# EAGLE design H16R6 (EAGLE 9.6.1)

## Sheet 1 of 3
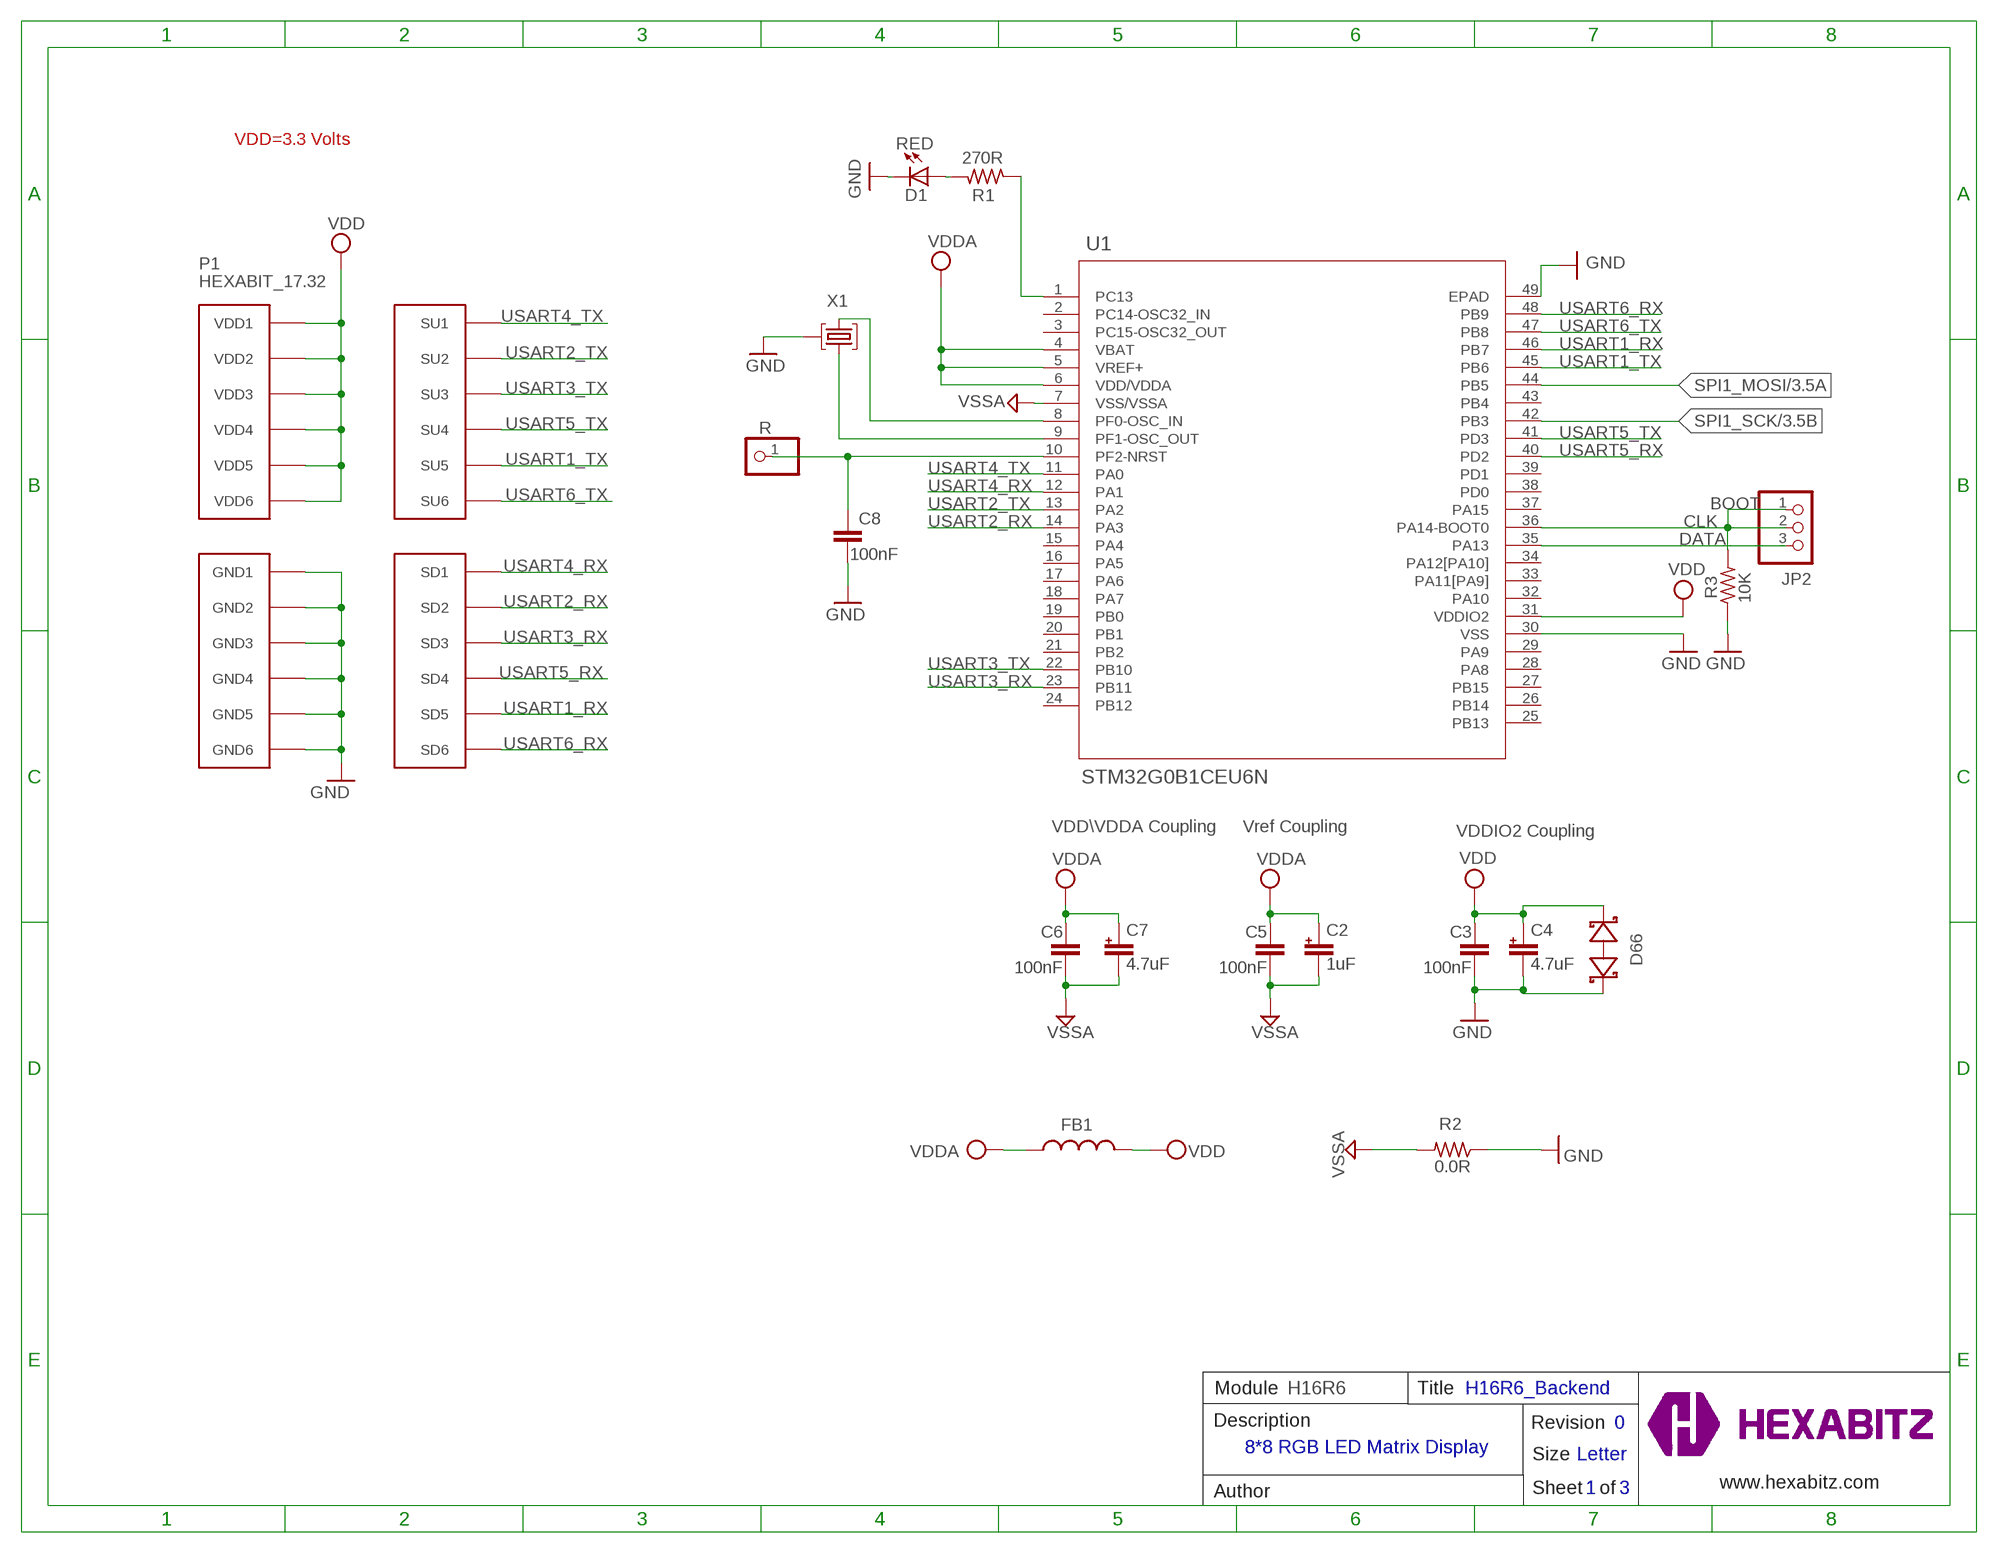
[diagram p0: schematic, sheet 1]

### Parts
C2  1uF  C-0402-POL  [C-0402-POL]
C3  100nF  C-0402  [C-0402]
C4  4.7uF  C-0402-POL  [C-0402-POL]
C5  100nF  C-0402  [C-0402]
C6  100nF  C-0402  [C-0402]
C7  4.7uF  C-0402-POL  [C-0402-POL]
C8  100nF  C-0402  [C-0402]
D1  RED  VLMS1300-GS08  [VLMS1300-GS08]
D66  BOURNS_CDSOD323-T03SCBOURNS_CDSOD323-T03SC_0_0  [BOURNS_CDSOD323-T03SC_0]
FB1  FB-TDK_MMZ1608Y300B  [FB-TDK_MMZ1608Y300B]
JP2  PINHD-1X3  [1X03]
P1  HEXABIT_17.32  [HEXABIT_17.32]
R  R  PINHD-1X1  [1X01]
R1  270R  R-0402  [R-0402]
R2  0.0R  R-0402  [R-0402]
R3  10K  R-0402  [R-0402]
TRIMBLE-LOGO1  HEXA-LOGO  [HEXA-LOGO]
U1  STM32G0B1CEU6N  [HEXABITZ_ICS_QFN_B1CEU6_STM-L]
X1  XTALL_CSTCE8M00G52  [XTALL_CSTCE8M00G52]

### Nets
CLK: JP2.1 JP2.2 R3.2 U1.36(PA14-BOOT0)
DATA: JP2.3 U1.35(PA13)
GND: C3.2 C4.2 C8.2 D1.C D66.1(A) P1.PAD_PD7(GND1) P1.PAD_PD8(GND2) P1.PAD_PD9(GND3) P1.PAD_PD10(GND4) P1.PAD_PD11(GND5) P1.PAD_PD12(GND6) R2.1 R3.1 U1.30(VSS) U1.49(EPAD) X1.P$2 ; also sheet 2,3
N$3: D1.A R1.2
N$4: C8.1 R.1 U1.10(PF2-NRST)
N$5: U1.9(PF1-OSC_OUT) X1.P$1
N$6: U1.8(PF0-OSC_IN) X1.P$3
N$117: R1.1 U1.1(PC13)
SPI1_MOSI: U1.44(PB5) ; also sheet 3
SPI1_SCK: U1.42(PB3) ; also sheet 3
USART1_RX: P1.PAD_PD5(SD5) U1.46(PB7)
USART1_TX: P1.PAD_PU5(SU5) U1.45(PB6)
USART2_RX: P1.PAD_PD2(SD2) U1.14(PA3)
USART2_TX: P1.PAD_PU2(SU2) U1.13(PA2)
USART3_RX: P1.PAD_PD3(SD3) U1.23(PB11)
USART3_TX: P1.PAD_PU3(SU3) U1.22(PB10)
USART4_RX: P1.PAD_PD1(SD1) U1.12(PA1)
USART4_TX: P1.PAD_PU1(SU1) U1.11(PA0)
USART5_RX: P1.PAD_PD4(SD4) U1.40(PD2)
USART5_TX: P1.PAD_PU4(SU4) U1.41(PD3)
USART6_RX: P1.PAD_PD6(SD6) U1.48(PB9)
USART6_TX: P1.PAD_PU6(SU6) U1.47(PB8)
VDD: C3.1 C4.1 D66.2(C) FB1.2 P1.PAD_PU7(VDD1) P1.PAD_PU8(VDD2) P1.PAD_PU9(VDD3) P1.PAD_PU10(VDD4) P1.PAD_PU11(VDD5) P1.PAD_PU12(VDD6) U1.31(VDDIO2) ; also sheet 3
VDDA: C2.1 C5.1 C6.1 C7.1 FB1.1 U1.4(VBAT) U1.5(VREF+) U1.6(VDD/VDDA)
VSSA: C2.2 C5.2 C6.2 C7.2 R2.2 U1.7(VSS/VSSA)
Unconnected: U1.2(PC14-OSC32_IN) U1.3(PC15-OSC32_OUT) U1.15(PA4) U1.16(PA5) U1.17(PA6) U1.18(PA7) U1.19(PB0) U1.20(PB1) U1.21(PB2) U1.24(PB12) U1.25(PB13) U1.26(PB14) U1.27(PB15) U1.28(PA8) U1.29(PA9) U1.32(PA10) U1.33(PA11[PA9]) U1.34(PA12[PA10]) U1.37(PA15) U1.38(PD0) U1.39(PD1) U1.43(PB4)

### Notes on the sheet
- VDD=3.3 Volts
- BOOT
- VDD\VDDA Coupling | Vref Coupling | VDDIO2 Coupling
- Module | H16R6 | Title | H16R6_Backend
- Description | Revision | 0
- 8*8 RGB LED Matrix Display
- Size | Letter
- www.hexabitz.com
- Author | Sheet   of | 1 | 3
- C:/Users/Admin/Desktop/logodraft.bmp

## Sheet 2 of 3
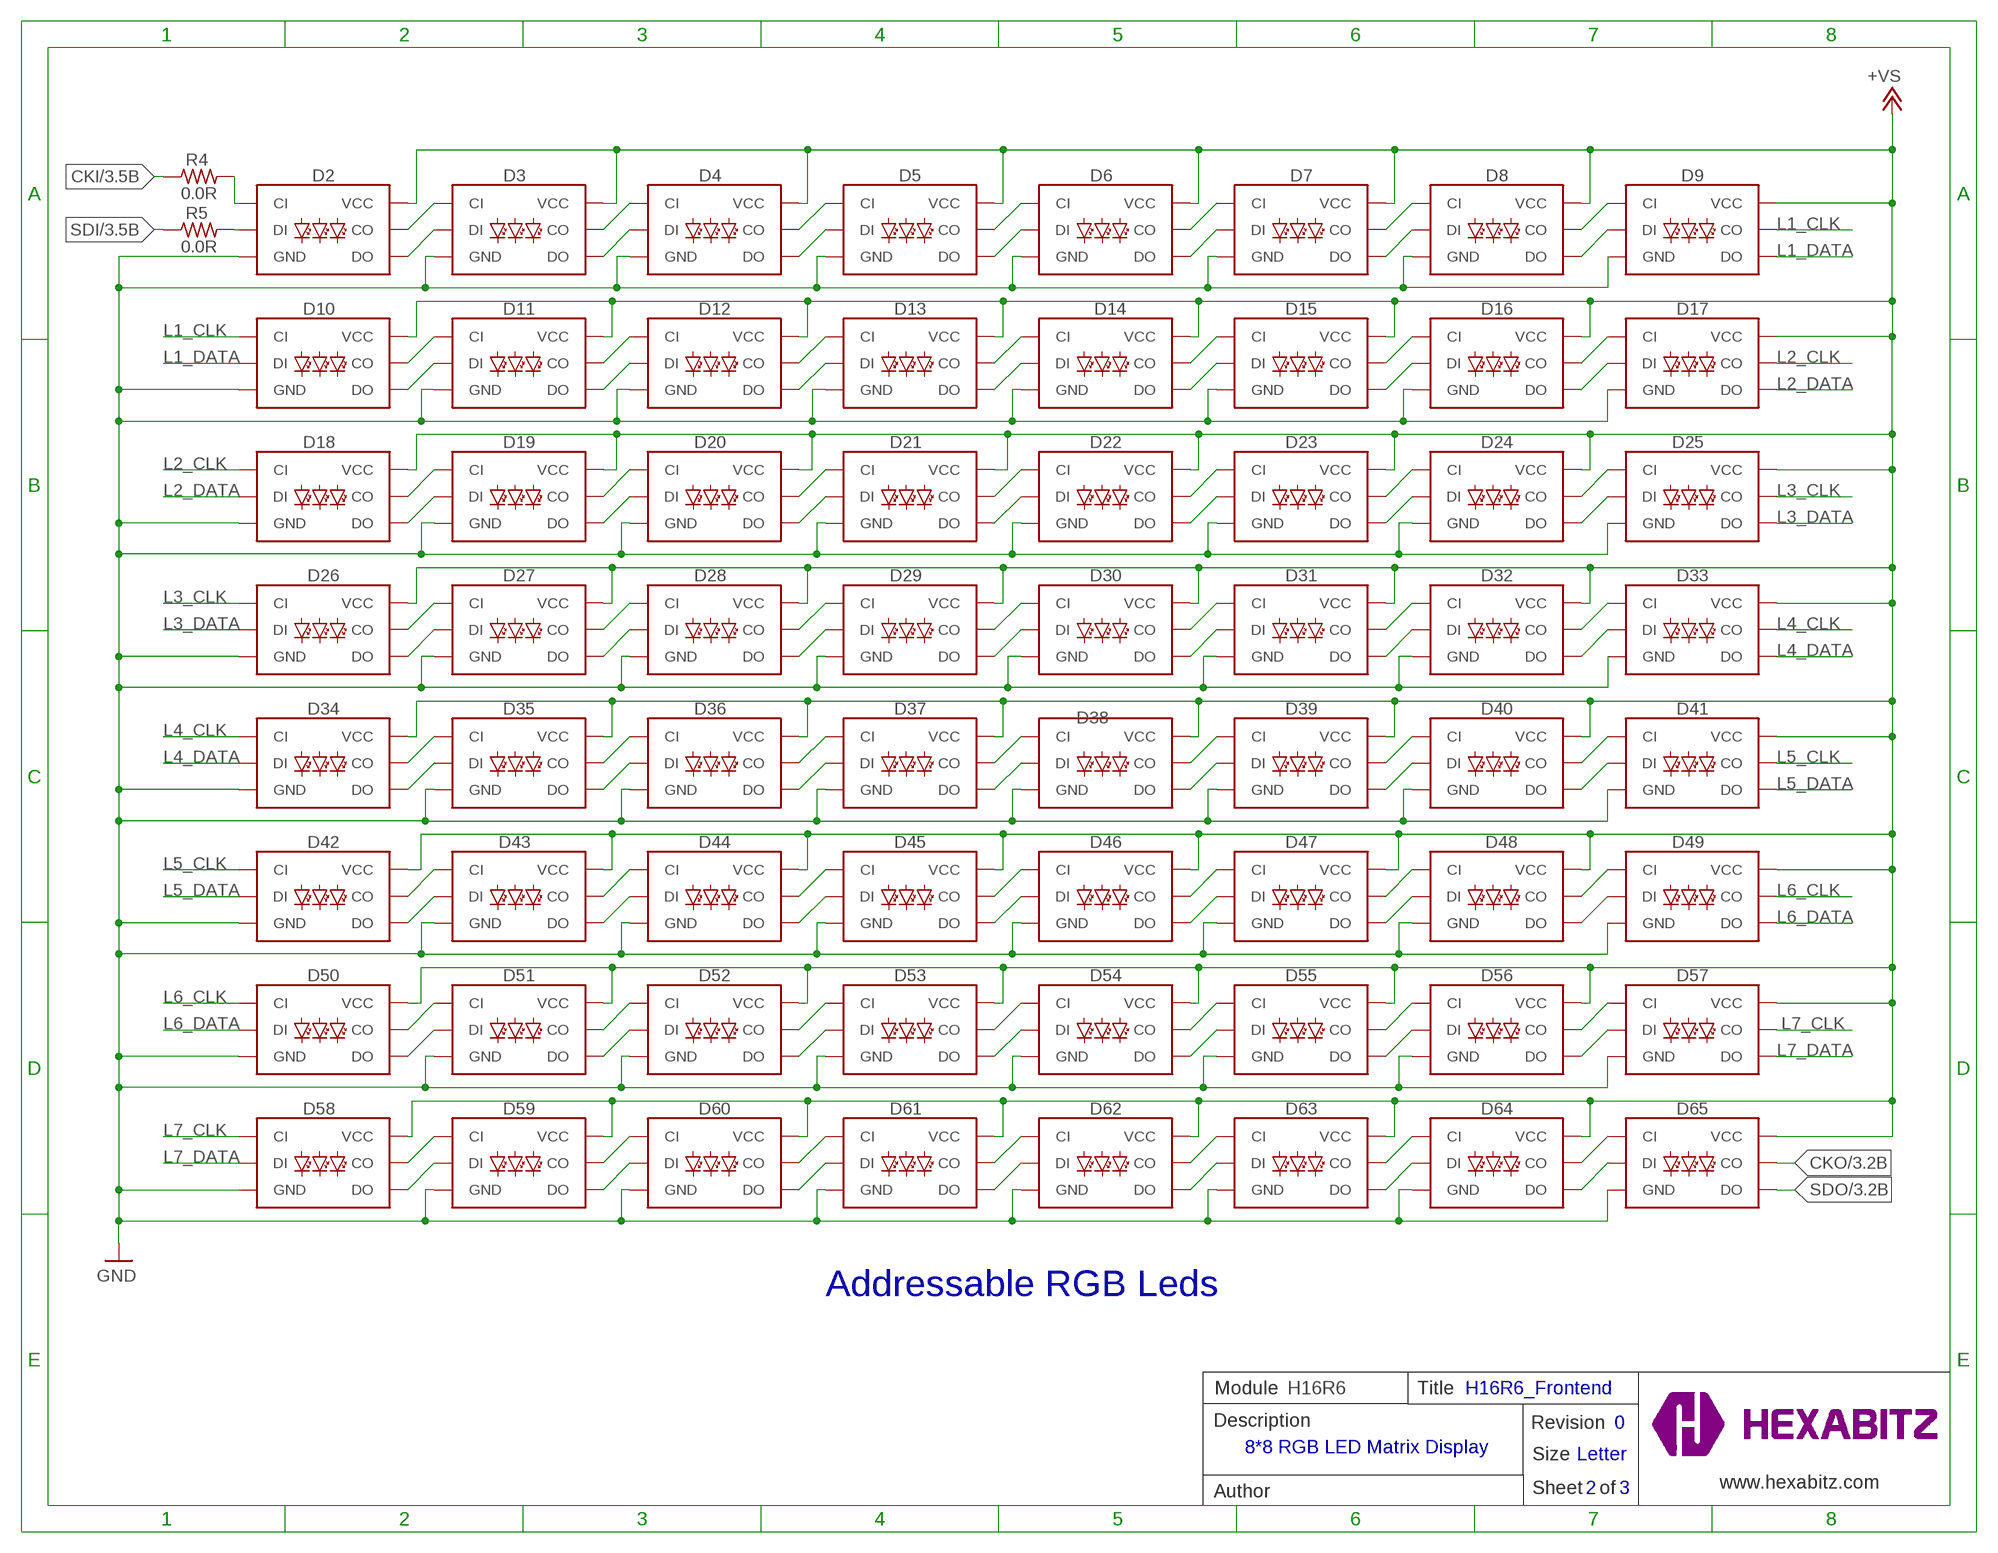
[diagram p1: schematic, sheet 2]

### Parts
D2  SPARKFUN-LED_APA102-2020  [SPARKFUN-LED_APA102-2020]
D3  SPARKFUN-LED_APA102-2020  [SPARKFUN-LED_APA102-2020]
D4  SPARKFUN-LED_APA102-2020  [SPARKFUN-LED_APA102-2020]
D5  SPARKFUN-LED_APA102-2020  [SPARKFUN-LED_APA102-2020]
D6  SPARKFUN-LED_APA102-2020  [SPARKFUN-LED_APA102-2020]
D7  SPARKFUN-LED_APA102-2020  [SPARKFUN-LED_APA102-2020]
D8  SPARKFUN-LED_APA102-2020  [SPARKFUN-LED_APA102-2020]
D9  SPARKFUN-LED_APA102-2020  [SPARKFUN-LED_APA102-2020]
D10  SPARKFUN-LED_APA102-2020  [SPARKFUN-LED_APA102-2020]
D11  SPARKFUN-LED_APA102-2020  [SPARKFUN-LED_APA102-2020]
D12  SPARKFUN-LED_APA102-2020  [SPARKFUN-LED_APA102-2020]
D13  SPARKFUN-LED_APA102-2020  [SPARKFUN-LED_APA102-2020]
D14  SPARKFUN-LED_APA102-2020  [SPARKFUN-LED_APA102-2020]
D15  SPARKFUN-LED_APA102-2020  [SPARKFUN-LED_APA102-2020]
D16  SPARKFUN-LED_APA102-2020  [SPARKFUN-LED_APA102-2020]
D17  SPARKFUN-LED_APA102-2020  [SPARKFUN-LED_APA102-2020]
D18  SPARKFUN-LED_APA102-2020  [SPARKFUN-LED_APA102-2020]
D19  SPARKFUN-LED_APA102-2020  [SPARKFUN-LED_APA102-2020]
D20  SPARKFUN-LED_APA102-2020  [SPARKFUN-LED_APA102-2020]
D21  SPARKFUN-LED_APA102-2020  [SPARKFUN-LED_APA102-2020]
D22  SPARKFUN-LED_APA102-2020  [SPARKFUN-LED_APA102-2020]
D23  SPARKFUN-LED_APA102-2020  [SPARKFUN-LED_APA102-2020]
D24  SPARKFUN-LED_APA102-2020  [SPARKFUN-LED_APA102-2020]
D25  SPARKFUN-LED_APA102-2020  [SPARKFUN-LED_APA102-2020]
D26  SPARKFUN-LED_APA102-2020  [SPARKFUN-LED_APA102-2020]
D27  SPARKFUN-LED_APA102-2020  [SPARKFUN-LED_APA102-2020]
D28  SPARKFUN-LED_APA102-2020  [SPARKFUN-LED_APA102-2020]
D29  SPARKFUN-LED_APA102-2020  [SPARKFUN-LED_APA102-2020]
D30  SPARKFUN-LED_APA102-2020  [SPARKFUN-LED_APA102-2020]
D31  SPARKFUN-LED_APA102-2020  [SPARKFUN-LED_APA102-2020]
D32  SPARKFUN-LED_APA102-2020  [SPARKFUN-LED_APA102-2020]
D33  SPARKFUN-LED_APA102-2020  [SPARKFUN-LED_APA102-2020]
D34  SPARKFUN-LED_APA102-2020  [SPARKFUN-LED_APA102-2020]
D35  SPARKFUN-LED_APA102-2020  [SPARKFUN-LED_APA102-2020]
D36  SPARKFUN-LED_APA102-2020  [SPARKFUN-LED_APA102-2020]
D37  SPARKFUN-LED_APA102-2020  [SPARKFUN-LED_APA102-2020]
D38  SPARKFUN-LED_APA102-2020  [SPARKFUN-LED_APA102-2020]
D39  SPARKFUN-LED_APA102-2020  [SPARKFUN-LED_APA102-2020]
D40  SPARKFUN-LED_APA102-2020  [SPARKFUN-LED_APA102-2020]
D41  SPARKFUN-LED_APA102-2020  [SPARKFUN-LED_APA102-2020]
D42  SPARKFUN-LED_APA102-2020  [SPARKFUN-LED_APA102-2020]
D43  SPARKFUN-LED_APA102-2020  [SPARKFUN-LED_APA102-2020]
D44  SPARKFUN-LED_APA102-2020  [SPARKFUN-LED_APA102-2020]
D45  SPARKFUN-LED_APA102-2020  [SPARKFUN-LED_APA102-2020]
D46  SPARKFUN-LED_APA102-2020  [SPARKFUN-LED_APA102-2020]
D47  SPARKFUN-LED_APA102-2020  [SPARKFUN-LED_APA102-2020]
D48  SPARKFUN-LED_APA102-2020  [SPARKFUN-LED_APA102-2020]
D49  SPARKFUN-LED_APA102-2020  [SPARKFUN-LED_APA102-2020]
D50  SPARKFUN-LED_APA102-2020  [SPARKFUN-LED_APA102-2020]
D51  SPARKFUN-LED_APA102-2020  [SPARKFUN-LED_APA102-2020]
D52  SPARKFUN-LED_APA102-2020  [SPARKFUN-LED_APA102-2020]
D53  SPARKFUN-LED_APA102-2020  [SPARKFUN-LED_APA102-2020]
D54  SPARKFUN-LED_APA102-2020  [SPARKFUN-LED_APA102-2020]
D55  SPARKFUN-LED_APA102-2020  [SPARKFUN-LED_APA102-2020]
D56  SPARKFUN-LED_APA102-2020  [SPARKFUN-LED_APA102-2020]
D57  SPARKFUN-LED_APA102-2020  [SPARKFUN-LED_APA102-2020]
D58  SPARKFUN-LED_APA102-2020  [SPARKFUN-LED_APA102-2020]
D59  SPARKFUN-LED_APA102-2020  [SPARKFUN-LED_APA102-2020]
D60  SPARKFUN-LED_APA102-2020  [SPARKFUN-LED_APA102-2020]
D61  SPARKFUN-LED_APA102-2020  [SPARKFUN-LED_APA102-2020]
D62  SPARKFUN-LED_APA102-2020  [SPARKFUN-LED_APA102-2020]
D63  SPARKFUN-LED_APA102-2020  [SPARKFUN-LED_APA102-2020]
D64  SPARKFUN-LED_APA102-2020  [SPARKFUN-LED_APA102-2020]
D65  SPARKFUN-LED_APA102-2020  [SPARKFUN-LED_APA102-2020]
R4  0.0R  R-0402  [R-0402]
R5  0.0R  R-0402  [R-0402]

### Nets
+VS: D2.VDD1(VCC) D2.VDD(VCC) D3.VDD1(VCC) D3.VDD(VCC) D4.VDD1(VCC) D4.VDD(VCC) D5.VDD1(VCC) D5.VDD(VCC) D6.VDD1(VCC) D6.VDD(VCC) D7.VDD1(VCC) D7.VDD(VCC) D8.VDD1(VCC) D8.VDD(VCC) D9.VDD1(VCC) D9.VDD(VCC) D10.VDD1(VCC) D10.VDD(VCC) D11.VDD1(VCC) D11.VDD(VCC) D12.VDD1(VCC) D12.VDD(VCC) D13.VDD1(VCC) D13.VDD(VCC) D14.VDD1(VCC) D14.VDD(VCC) D15.VDD1(VCC) D15.VDD(VCC) D16.VDD1(VCC) D16.VDD(VCC) D17.VDD1(VCC) D17.VDD(VCC) D18.VDD1(VCC) D18.VDD(VCC) D19.VDD1(VCC) D19.VDD(VCC) D20.VDD1(VCC) D20.VDD(VCC) D21.VDD1(VCC) D21.VDD(VCC) D22.VDD1(VCC) D22.VDD(VCC) D23.VDD1(VCC) D23.VDD(VCC) D24.VDD1(VCC) D24.VDD(VCC) D25.VDD1(VCC) D25.VDD(VCC) D26.VDD1(VCC) D26.VDD(VCC) D27.VDD1(VCC) D27.VDD(VCC) D28.VDD1(VCC) D28.VDD(VCC) D29.VDD1(VCC) D29.VDD(VCC) D30.VDD1(VCC) D30.VDD(VCC) D31.VDD1(VCC) D31.VDD(VCC) D32.VDD1(VCC) D32.VDD(VCC) D33.VDD1(VCC) D33.VDD(VCC) D34.VDD1(VCC) D34.VDD(VCC) D35.VDD1(VCC) D35.VDD(VCC) D36.VDD1(VCC) D36.VDD(VCC) D37.VDD1(VCC) D37.VDD(VCC) D38.VDD1(VCC) D38.VDD(VCC) D39.VDD1(VCC) D39.VDD(VCC) D40.VDD1(VCC) D40.VDD(VCC) D41.VDD1(VCC) D41.VDD(VCC) D42.VDD1(VCC) D42.VDD(VCC) D43.VDD1(VCC) D43.VDD(VCC) D44.VDD1(VCC) D44.VDD(VCC) D45.VDD1(VCC) D45.VDD(VCC) D46.VDD1(VCC) D46.VDD(VCC) D47.VDD1(VCC) D47.VDD(VCC) D48.VDD1(VCC) D48.VDD(VCC) D49.VDD1(VCC) D49.VDD(VCC) D50.VDD1(VCC) D50.VDD(VCC) D51.VDD1(VCC) D51.VDD(VCC) D52.VDD1(VCC) D52.VDD(VCC) D53.VDD1(VCC) D53.VDD(VCC) D54.VDD1(VCC) D54.VDD(VCC) D55.VDD1(VCC) D55.VDD(VCC) D56.VDD1(VCC) D56.VDD(VCC) D57.VDD1(VCC) D57.VDD(VCC) D58.VDD1(VCC) D58.VDD(VCC) D59.VDD1(VCC) D59.VDD(VCC) D60.VDD1(VCC) D60.VDD(VCC) D61.VDD1(VCC) D61.VDD(VCC) D62.VDD1(VCC) D62.VDD(VCC) D63.VDD1(VCC) D63.VDD(VCC) D64.VDD1(VCC) D64.VDD(VCC) D65.VDD1(VCC) D65.VDD(VCC) ; also sheet 3
CKI: R4.1 ; also sheet 3
CKO: D65.CO ; also sheet 3
GND: D2.GND D3.GND D4.GND D5.GND D6.GND D7.GND D8.GND D9.GND D10.GND D11.GND D12.GND D13.GND D14.GND D15.GND D16.GND D17.GND D18.GND D19.GND D20.GND D21.GND D22.GND D23.GND D24.GND D25.GND D26.GND D27.GND D28.GND D29.GND D30.GND D31.GND D32.GND D33.GND D34.GND D35.GND D36.GND D37.GND D38.GND D39.GND D40.GND D41.GND D42.GND D43.GND D44.GND D45.GND D46.GND D47.GND D48.GND D49.GND D50.GND D51.GND D52.GND D53.GND D54.GND D55.GND D56.GND D57.GND D58.GND D59.GND D60.GND D61.GND D62.GND D63.GND D64.GND D65.GND ; also sheet 1,3
L1_CLK: D9.CO D10.CI
L1_DATA: D9.DO D10.DI
L2_CLK: D17.CO D18.CI
L2_DATA: D17.DO D18.DI
L3_CLK: D25.CO D26.CI
L3_DATA: D25.DO D26.DI
L4_CLK: D33.CO D34.CI
L4_DATA: D33.DO D34.DI
L5_CLK: D41.CO D42.CI
L5_DATA: D41.DO D42.DI
L6_CLK: D49.CO D50.CI
L6_DATA: D49.DO D50.DI
L7_CLK: D57.CO D58.CI
L7_DATA: D57.DO D58.DI
N$1: D3.DO D4.DI
N$2: D3.CO D4.CI
N$7: D2.DO D3.DI
N$8: D2.CO D3.CI
N$9: D8.DO D9.DI
N$10: D8.CO D9.CI
N$11: D7.CO D8.CI
N$12: D7.DO D8.DI
N$13: D5.CO D6.CI
N$14: D5.DO D6.DI
N$15: D16.CO D17.CI
N$16: D16.DO D17.DI
N$17: D10.CO D11.CI
N$18: D10.DO D11.DI
N$19: D11.CO D12.CI
N$20: D11.DO D12.DI
N$21: D12.CO D13.CI
N$22: D18.CO D19.CI
N$23: D18.DO D19.DI
N$24: D19.CO D20.CI
N$25: D19.DO D20.DI
N$26: D20.CO D21.CI
N$27: D20.DO D21.DI
N$28: D21.CO D22.CI
N$29: D21.DO D22.DI
N$30: D22.CO D23.CI
N$31: D22.DO D23.DI
N$32: D23.CO D24.CI
N$33: D23.DO D24.DI
N$34: D24.CO D25.CI
N$35: D24.DO D25.DI
N$36: D26.CO D27.CI
N$37: D26.DO D27.DI
N$38: D27.CO D28.CI
N$39: D27.DO D28.DI
N$40: D28.CO D29.CI
N$41: D28.DO D29.DI
N$42: D29.CO D30.CI
N$43: D29.DO D30.DI
N$44: D31.CO D32.CI
N$45: D31.DO D32.DI
N$46: D30.CO D31.CI
N$47: D30.DO D31.DI
N$48: D32.CO D33.CI
N$49: D32.DO D33.DI
N$50: D34.CO D35.CI
N$51: D34.DO D35.DI
N$52: D35.CO D36.CI
N$53: D35.DO D36.DI
N$54: D36.CO D37.CI
N$55: D36.DO D37.DI
N$56: D37.CO D38.CI
N$57: D37.DO D38.DI
N$58: D38.CO D39.CI
N$59: D38.DO D39.DI
N$60: D40.CO D41.CI
N$61: D40.DO D41.DI
N$62: D39.CO D40.CI
N$63: D39.DO D40.DI
N$64: D48.CO D49.CI
N$65: D48.DO D49.DI
N$66: D56.CO D57.CI
N$67: D56.DO D57.DI
N$68: D64.CO D65.CI
N$69: D64.DO D65.DI
N$70: D55.DO D56.DI
N$71: D55.CO D56.CI
N$72: D63.CO D64.CI
N$73: D63.DO D64.DI
N$74: D54.CO D55.CI
N$75: D54.DO D55.DI
N$76: D62.CO D63.CI
N$77: D62.DO D63.DI
N$78: D61.DO D62.DI
N$79: D61.CO D62.CI
N$80: D60.CO D61.CI
N$81: D60.DO D61.DI
N$82: D59.CO D60.CI
N$83: D59.DO D60.DI
N$84: D58.DO D59.DI
N$85: D58.CO D59.CI
N$86: D53.DO D54.DI
N$87: D53.CO D54.CI
N$88: D51.CO D52.CI
N$89: D51.DO D52.DI
N$90: D52.DO D53.DI
N$91: D52.CO D53.CI
N$92: D50.DO D51.DI
N$93: D50.CO D51.CI
N$94: D42.CO D43.CI
N$95: D42.DO D43.DI
N$96: D43.CO D44.CI
N$97: D43.DO D44.DI
N$98: D44.CO D45.CI
N$99: D44.DO D45.DI
N$100: D45.DO D46.DI
N$101: D45.CO D46.CI
N$102: D46.CO D47.CI
N$103: D46.DO D47.DI
N$104: D47.CO D48.CI
N$105: D47.DO D48.DI
N$106: D12.DO D13.DI
N$107: D13.DO D14.DI
N$108: D13.CO D14.CI
N$109: D14.CO D15.CI
N$110: D14.DO D15.DI
N$111: D15.CO D16.CI
N$112: D15.DO D16.DI
N$113: D4.CO D5.CI
N$114: D4.DO D5.DI
N$115: D6.CO D7.CI
N$116: D6.DO D7.DI
N$119: D2.DI R5.2
N$120: D2.CI R4.2
SDI: R5.1 ; also sheet 3
SDO: D65.DO ; also sheet 3

### Notes on the sheet
- Addressable RGB Leds
- Module | H16R6 | Title | H16R6_Frontend
- Description | Revision | 0
- 8*8 RGB LED Matrix Display
- Size | Letter
- www.hexabitz.com
- Author | Sheet   of | 2 | 3

## Sheet 3 of 3
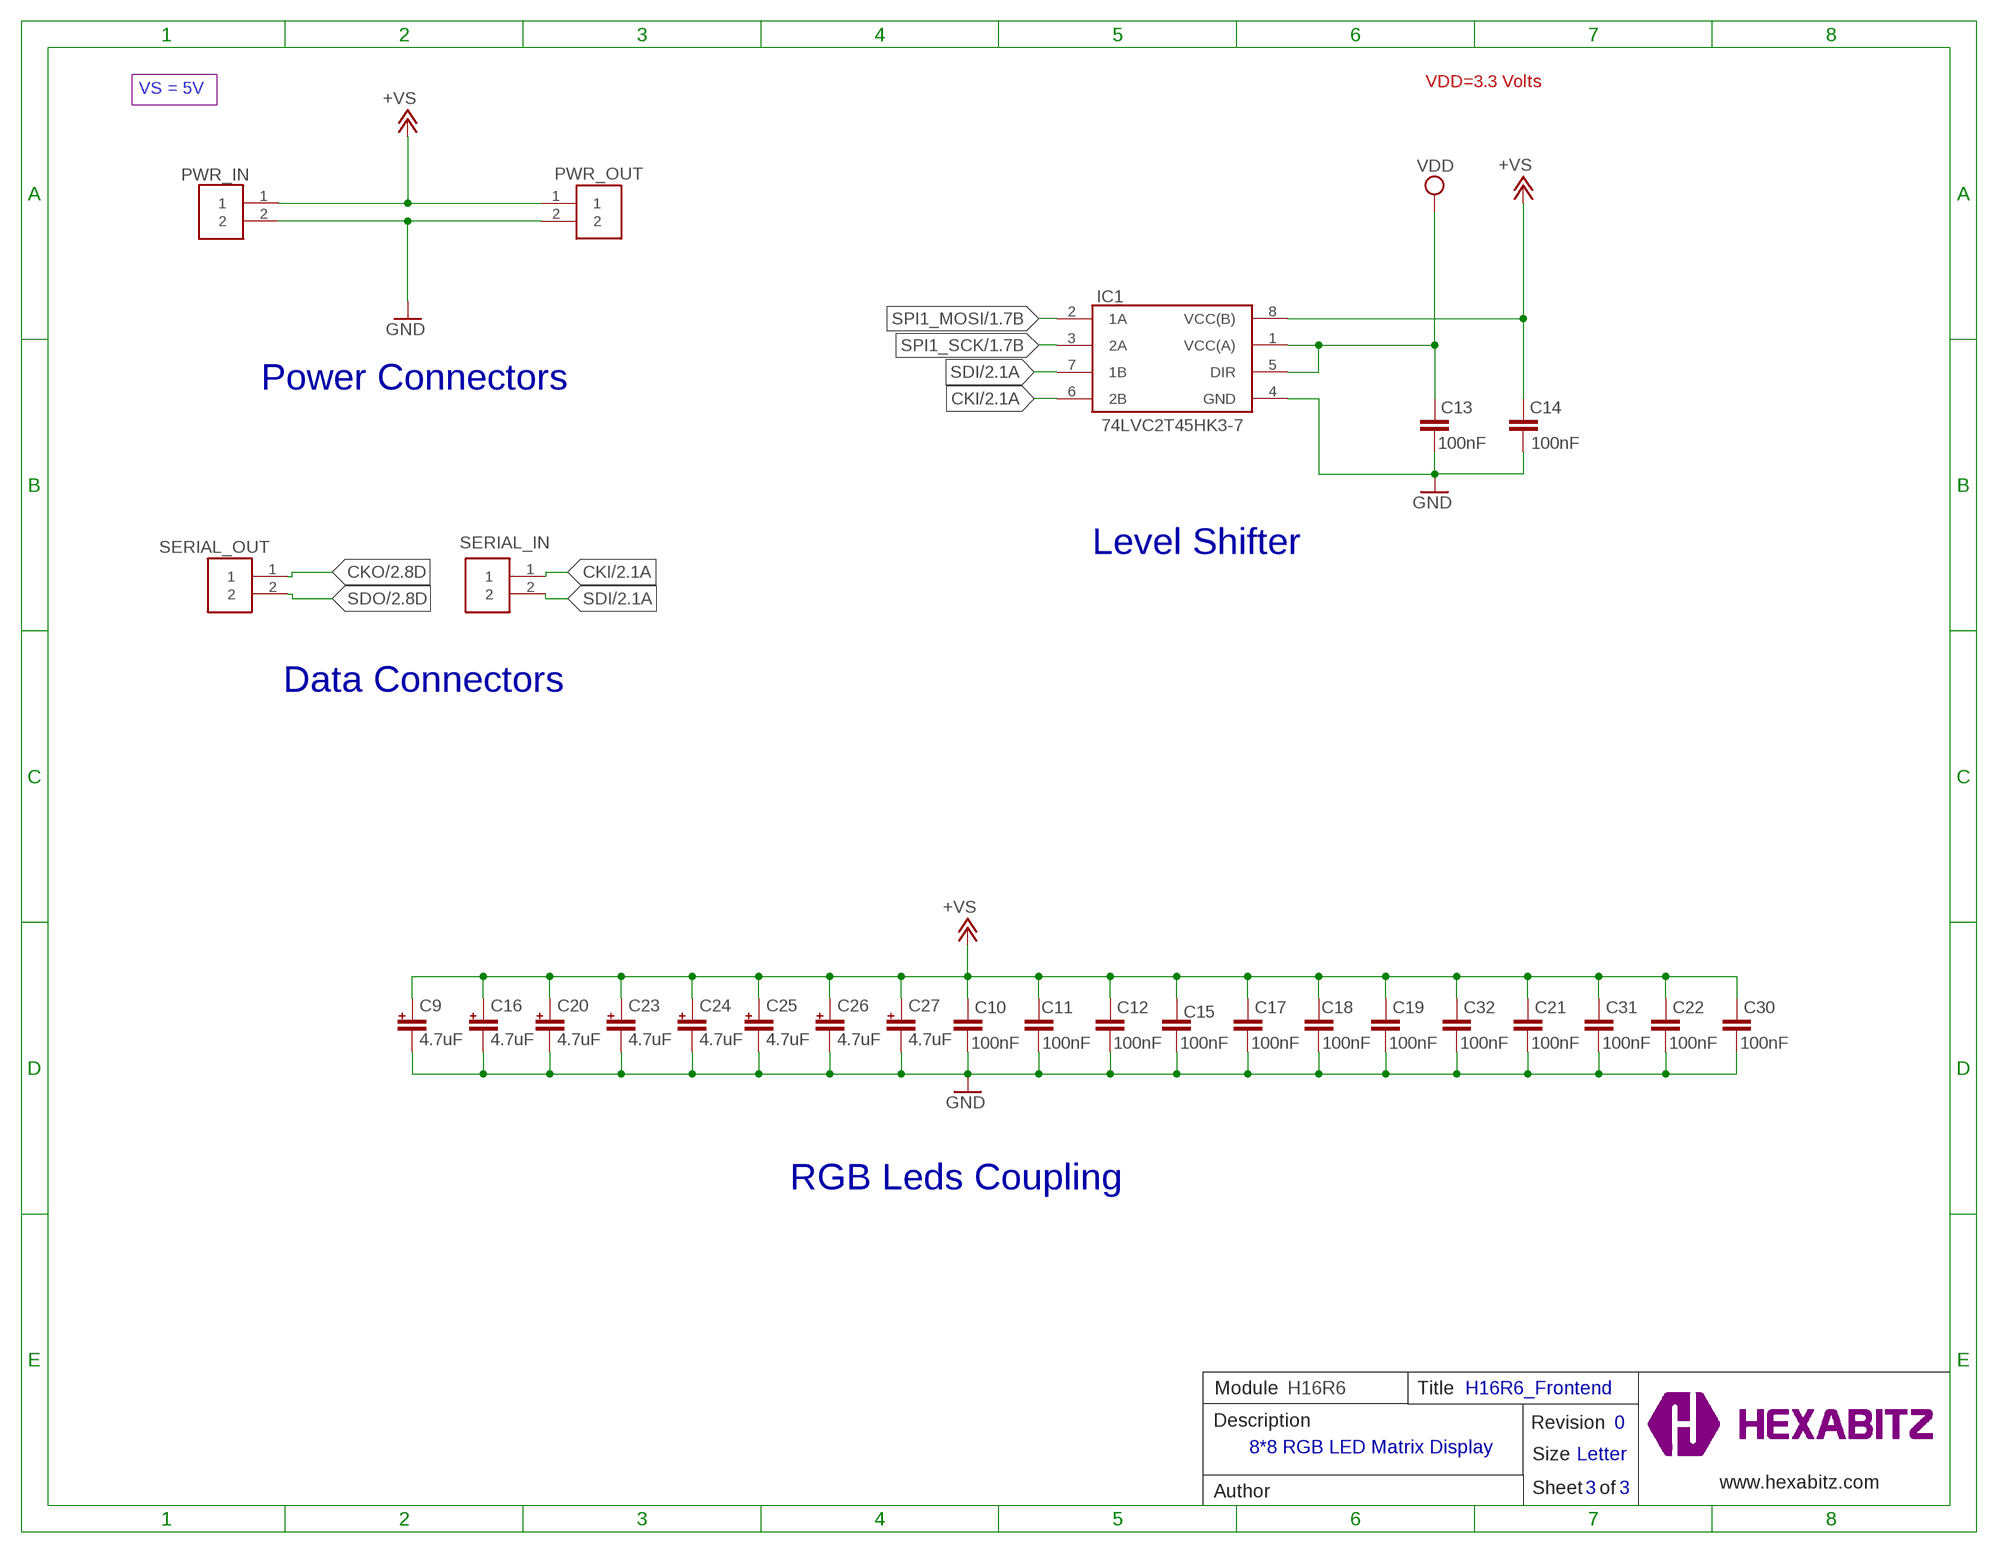
[diagram p2: schematic, sheet 3]

### Parts
C9  4.7uF  C-0402-POL  [C-0402-POL]
C10  100nF  C-0402  [C-0402]
C11  100nF  C-0402  [C-0402]
C12  100nF  C-0402  [C-0402]
C13  100nF  C-0402  [C-0402]
C14  100nF  C-0402  [C-0402]
C15  100nF  C-0402  [C-0402]
C16  4.7uF  C-0402-POL  [C-0402-POL]
C17  100nF  C-0402  [C-0402]
C18  100nF  C-0402  [C-0402]
C19  100nF  C-0402  [C-0402]
C20  4.7uF  C-0402-POL  [C-0402-POL]
C21  100nF  C-0402  [C-0402]
C22  100nF  C-0402  [C-0402]
C23  4.7uF  C-0402-POL  [C-0402-POL]
C24  4.7uF  C-0402-POL  [C-0402-POL]
C25  4.7uF  C-0402-POL  [C-0402-POL]
C26  4.7uF  C-0402-POL  [C-0402-POL]
C27  4.7uF  C-0402-POL  [C-0402-POL]
C30  100nF  C-0402  [C-0402]
C31  100nF  C-0402  [C-0402]
C32  100nF  C-0402  [C-0402]
IC1  74LVC2T45HK3-7  [74LVC2T45HK37]
PWR_IN  3-644456-2  [TE_3-644456-2]
PWR_OUT  3-644456-2  [TE_3-644456-2]
SERIAL_IN  3-644456-2  [TE_3-644456-2]
SERIAL_OUT  3-644456-2  [TE_3-644456-2]

### Nets
+VS: C9.1 C10.1 C11.1 C12.1 C14.1 C15.1 C16.1 C17.1 C18.1 C19.1 C20.1 C21.1 C22.1 C23.1 C24.1 C25.1 C26.1 C27.1 C30.1 C31.1 C32.1 IC1.8(VCC(B)) PWR_IN.1 PWR_OUT.1 ; also sheet 2
CKI: IC1.6(2B) SERIAL_IN.1 ; also sheet 2
CKO: SERIAL_OUT.1 ; also sheet 2
GND: C9.2 C10.2 C11.2 C12.2 C13.2 C14.2 C15.2 C16.2 C17.2 C18.2 C19.2 C20.2 C21.2 C22.2 C23.2 C24.2 C25.2 C26.2 C27.2 C30.2 C31.2 C32.2 IC1.4(GND) PWR_IN.2 PWR_OUT.2 ; also sheet 1,2
SDI: IC1.7(1B) SERIAL_IN.2 ; also sheet 2
SDO: SERIAL_OUT.2 ; also sheet 2
SPI1_MOSI: IC1.2(1A) ; also sheet 1
SPI1_SCK: IC1.3(2A) ; also sheet 1
VDD: C13.1 IC1.1(VCC(A)) IC1.5(DIR) ; also sheet 1

### Notes on the sheet
- VDD=3.3 Volts
- VS = 5V
- Power Connectors
- Level Shifter
- Data Connectors
- RGB Leds Coupling
- Module | H16R6 | Title | H16R6_Frontend
- Description | Revision | 0
- 8*8 RGB LED Matrix Display
- Size | Letter
- www.hexabitz.com
- Author | Sheet   of | 3 | 3

## Library data of the parts
C2 C4 C7 C9 C16 C20 C23-C27 = HEXABITZ_RCLS:C-0402-POL
C3 C5 C6 C8 C10-C15 C17-C19 C21 C22 C30-C32 = HEXABITZ_RCLS:C-0402: CAP CER 10% 0402
D1 = HEXABITZ_USER_INTERFACE_PARTS:VLMS1300-GS08: Red 0603 130° Clear 54 mcd 2 V Surface Mount ChipLED ; Octopart Url : http://octopart.com/vlms1300-gs08-vishay-21709201; MFN: Vishay; MPN: VLMS1300-GS08; OCTOPART_URL: https://octopart.com/vlms1300-gs08-vishay-21709201?r=sp&s=_gcP4_q8T1SC6PJQPTQ9yA
D2-D65 = HEXABITZ_ICs:SPARKFUN-LED_APA102: APA102 Addressable RGB LED Used in manufacturing of various products at SparkFun Packages: 5050 2020 SparkFun Products: SparkFun Lumenati Boards <https://www.sparkfun.com/categories/405>; PROD_ID: DIO-13883
D66 = HEXABITZ_RCLS:BOURNS_CDSOD323-T03SC: CDSOD323-TxxSC - TVS Diode Series; DESCRIPTION: Dio Tvs Vwm 03V 500W Bidir Sod323 / Tape & Reel - 7" Reel; MFN: Bourns; MPN: CDSOD323-T03SC; OCTOPART_URL: https://octopart.com/cdsod323-t03sc-bourns-10487153?r=sp
FB1 = HEXABITZ_RCLS:FB-TDK_MMZ1608Y300B: Ferrite Beads Multi-Layer 30Ohm 25% 100MHz 1.5A 50mOhm DCR 0603; MFN: TDK; MPN: MMZ1608Y300B; OCTOPART_URL: https://octopart.com/mmz1608y300b-tdk-368280?r=sp&s=cd9_2ZEqQ9q9UNBuQgHAiA
IC1 = HEXABITZ_ICs:74LVC2T45HK3-7: DUAL BIT DUAL POWER SUPPLY TRANSLATING TRANSCEIVER WITH 3 STATE OUTPUTS Source: Datasheet <https://datasheet.datasheetarchive.com/originals/distributors/Datasheets_SAMA/aa31840c3a533bb6eb583ad3d3f505ac.pdf>; DESCRIPTION: DUAL BIT DUAL POWER SUPPLY TRANSLATING TRANSCEIVER WITH 3 STATE OUTPUTS; HEIGHT: 0.35mm; MANUFACTURER_NAME: Diodes Incorporated; MANUFACTURER_PART_NUMBER: 74LVC2T45HK3-7; MOUSER_PART_NUMBER: 621-74LVC2T45HK3-7; MOUSER_PRICE-STOCK: https://www.mouser.co.uk/ProductDetail/Diodes-Incorporated/74LVC2T45HK3-7?qs=pUKx8fyJudBbmJGmGzYY0g%3D%3D
JP2 = pinhead:PINHD-1X3: PIN HEADER
P1 = hexabitz_connectors:HEXABIT_?: Hexabitz Hexagon Module Connector Hexagon side length = 28.87mm.
PWR_IN PWR_OUT SERIAL_IN SERIAL_OUT = HEXABITZ_USER_INTERFACE_PARTS:3-644456-2; AVAILABILITY: Unavailable; CENTERLINE_PITCH: 2.54 mm[.1 in]; COMMENT: 3-644456-2; DESCRIPTION: Connector Unshrouded Header HDR 2 Position 2.54mm Solder Straight Thru-Hole; EU_ROHS_COMPLIANCE: Compliant; MF: TE Connectivity; MFN: TE Connectivity; MP: 3-644456-2; MPN: 87224-1; NUMBER_OF_POSITIONS: 2; OCTOPART_URL: https://octopart.com/87224-1-te+connectivity-39512011?r=sp; PACKAGE: None; PRICE: None; PRODUCT_TYPE: Connector; TE_PURCHASE_URL: https://www.te.com/usa-en/product-3-644456-2.html?te_bu=Cor&te_type=disp&te_campaign=seda_glo_cor-seda-global-disp-prtnr-fy19-seda-model-bom-cta_sma-317_1&elqCampaignId=32493
R = HEXABITZ_USER_INTERFACE_PARTS:PINHD-1X1: PIN HEADER; MFN: TE Connectivity; MPN: 87227-1; OCTOPART_URL: https://octopart.com/87227-1-te+connectivity-39512052?r=sp
R1 R3-R5 = HEXABITZ_RCLS:R-0402: Thick Film Resistors - SMD 0603
R2 = HEXABITZ_RCLS:R-0402: Thick Film Resistors - SMD 0603; MFN: Yageo; MPN: RC0603JR-070RL; OCTOPART_URL: https://octopart.com/rc0603jr-070rl-yageo-1241539?r=sp&s=X2NteqRjRNWrnx42Y0aliA; RESISTANCE: 0.0 Ohm
TRIMBLE-LOGO1 = HEXABITZ_USER_INTERFACE_PARTS:HEXA-LOGO: Trimble-Logo
U1 = HEXABITZ_ICs:STM32G0B1CEU6N
X1 = HEXABITZ_RCLS:XTALL_CSTCE8M00G52: MURATA CSTCE8M00G52-R0 RESONATOR, SMD, 8MHZ ; Octopart Url : https://octopart.com/cstce8m00g52-r0-murata-7145559; MFN: Murata; MPN: CSTCE8M00G52Z-R0; OCTOPART_URL: https://octopart.com/cstce8m00g52z-r0-murata-17755941?r=sp&s=JDnNJnrHQhyS8Zk4ofFWXw

## Board
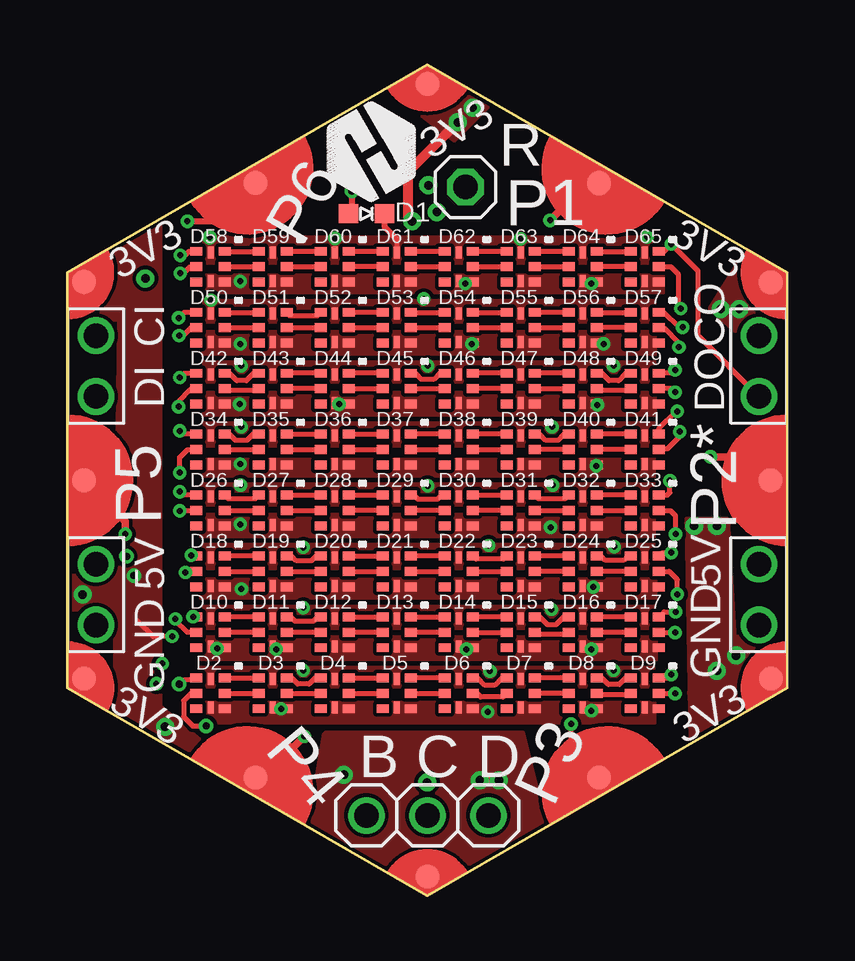
[diagram p3: board, top side]
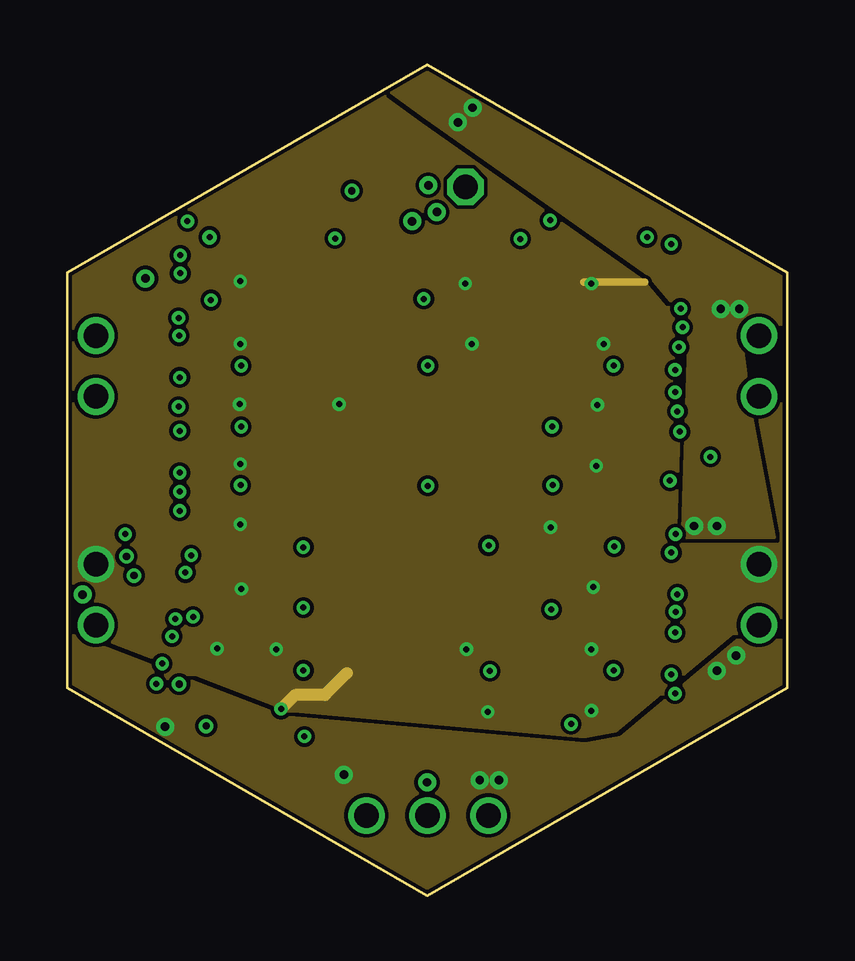
[diagram p4: board, inner layer Route2]
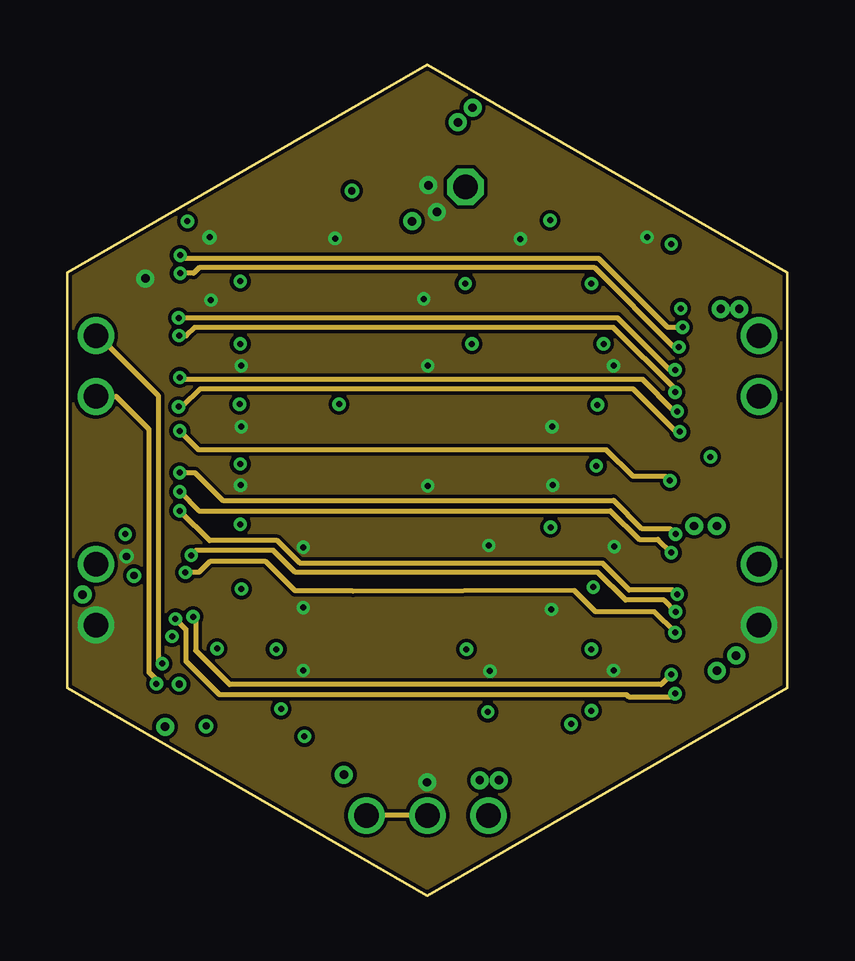
[diagram p5: board, inner layer Route15]
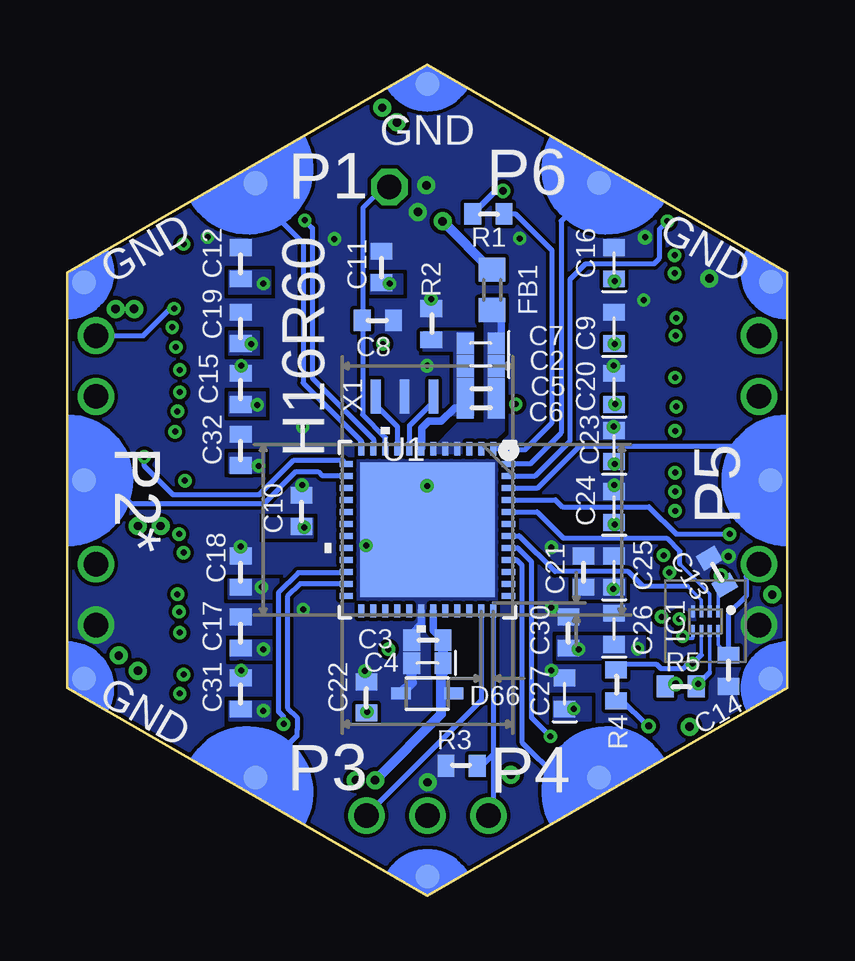
[diagram p6: board, bottom side, seen from below]

Size 30 x 34.64 mm. Coordinates in mm from the lower left corner, seen from the top.
Copper layers (1+2*15+16): Top 0.035mm / dielectric 0.175mm / Route2 0.035mm / dielectric 1.11mm / Route15 0.035mm / dielectric 0.175mm / Bottom 0.035mm
Design rules "4_layer *": minimum track width 5mil, minimum drill 0.2mm, track to track 6mil, track to pad 6mil, pad to pad 6mil, via to via 6mil, smd to smd 0mil, copper to edge 6mil, drill to drill 8mil, minimum pad ring 6mil, minimum via ring 6mil, stop-mask expansion 2mil, vias tented up to drill 15mil, thermal gap 10mil

### Footprints (pad centres in the part's own frame; a part is rotated, then mirrored left to right if it is on the bottom)
C-0402-POL = smd 0.7 x 0.9: 1 -0.65,0; 2 0.65,0
C-0402 = smd 0.7 x 0.9: 1 -0.65,0; 2 0.65,0
VLMS1300-GS08 = smd 0.8 x 0.8: A 0,0.75; C 0,-0.75
SPARKFUN-LED_APA102-2020 = smd 0.5 x 0.37: CI -0.572,0.011; CO 0.598,0.011; DI -0.572,0.651; DO 0.598,0.651; GND1 -0.572,-0.629; VDD1 0.598,-0.629 | smd 0.25 x 0.5: GND 0.013,0.6; VDD 0.013,-0.584
BOURNS_CDSOD323-T03SC_0 = smd 0.8 x 0.5: 1 -1.1,0; 2 1.1,0
FB-TDK_MMZ1608Y300B = smd 1 x 1.1: 1 -0.85,0; 2 0.85,0
74LVC2T45HK37 = smd 0.15 x 0.5: 1 -0.525,-0.4; 2 -0.175,-0.4; 3 0.175,-0.4; 4 0.525,-0.4; 5 0.525,0.4; 6 0.175,0.4; 7 -0.175,0.4; 8 -0.525,0.4
1X03 = drill 1.016: 1 -2.54,0; 2 0,0; 3 2.54,0
HEXABIT_17.32 = smd 1 x 1 bottom: PAD_PD1 12.39,7.15; PAD_PD2 12.39,-7.15; PAD_PD3 0,-14.31; PAD_PD4 -12.39,-7.15; PAD_PD5 -12.39,7.15; PAD_PD6 0,14.31; PAD_PD7 8.26,14.31; PAD_PD8 16.52,0; PAD_PD9 8.26,-14.31; PAD_PD10 -8.26,-14.31; PAD_PD11 -16.52,0; PAD_PD12 -8.26,14.31 | smd 1 x 1: PAD_PU1 12.39,7.15; PAD_PU2 12.39,-7.15; PAD_PU3 0,-14.31; PAD_PU4 -12.39,-7.15; PAD_PU5 -12.39,7.15; PAD_PU6 0,14.31; PAD_PU7 8.26,14.31; PAD_PU8 16.52,0; PAD_PU9 8.26,-14.31; PAD_PU10 -8.26,-14.31; PAD_PU11 -16.52,0; PAD_PU12 -8.26,14.31
TE_3-644456-2 = drill 1.02 pad 1.37: 1 0,0; 2 2.54,0
1X01 = drill 1.016 octagon: 1 0,0
R-0402 = smd 0.7 x 0.9: 1 -0.65,0; 2 0.65,0
HEXABITZ_ICS_QFN_B1CEU6_STM-L = smd 0.55 x 0.254: 1 -3.38,2.751; 2 -3.38,2.251; 3 -3.38,1.75; 4 -3.38,1.25; 5 -3.38,0.75; 6 -3.38,0.25; 7 -3.38,-0.25; 8 -3.38,-0.75; 9 -3.38,-1.25; 10 -3.38,-1.75; 11 -3.38,-2.251; 12 -3.38,-2.751; 25 3.38,-2.751; 26 3.38,-2.251; 27 3.38,-1.75; 28 3.38,-1.25; 29 3.38,-0.75; 30 3.38,-0.25; 31 3.38,0.25; 32 3.38,0.75; 33 3.38,1.25; 34 3.38,1.75; 35 3.38,2.251; 36 3.38,2.751 | smd 0.254 x 0.55: 13 -2.751,-3.38; 14 -2.251,-3.38; 15 -1.75,-3.38; 16 -1.25,-3.38; 17 -0.75,-3.38; 18 -0.25,-3.38; 19 0.25,-3.38; 20 0.75,-3.38; 21 1.25,-3.38; 22 1.75,-3.38; 23 2.251,-3.38; 24 2.751,-3.38; 37 2.751,3.38; 38 2.251,3.38; 39 1.75,3.38; 40 1.25,3.38; 41 0.75,3.38; 42 0.25,3.38; 43 -0.25,3.38; 44 -0.75,3.38; 45 -1.25,3.38; 46 -1.75,3.38; 47 -2.251,3.38; 48 -2.751,3.38 | smd 5.6 x 5.6: 49 0,0
XTALL_CSTCE8M00G52 = smd 1.4 x 0.4: P$1 0,1.2; P$2 0,0; P$3 0,-1.2

### Placement (x,y rotation side)
C2  12.78,22.08 180 bottom
C3  15,10.65 180 bottom
C4  15,9.7 180 bottom
C5  12.78,21.13 180 bottom
C6  12.78,20.34 180 bottom
C7  12.78,23.04 180 bottom
C8  17.06,23.99 0 bottom
C9  7.22,23.67 90 bottom
C10  20.24,16.05 90 bottom
C11  16.9,26.21 90 bottom
C12  22.78,26.37 90 bottom
C13  2.93,13.51 120 bottom
C14  2.46,9.38 270 bottom
C15  22.78,21.13 90 bottom
C16  7.22,26.37 90 bottom
C17  22.78,10.97 90 bottom
C18  22.78,13.51 90 bottom
C19  22.78,23.67 90 bottom
C20  7.22,21.13 90 bottom
C21  8.49,13.51 90 bottom
C22  17.54,8.27 90 bottom
C23  7.22,18.75 90 bottom
C24  7.22,16.21 90 bottom
C25  7.22,13.51 90 bottom
C26  7.22,11.13 90 bottom
C27  9.28,8.43 90 bottom
C30  9.13,10.97 90 bottom
C31  22.78,8.43 90 bottom
C32  22.78,18.59 90 bottom
D1  12.46,28.43 90 top
D2  5.95,8.43 0 top
D3  8.54,8.43 0 top
D4  11.12,8.43 0 top
D5  13.71,8.43 0 top
D6  16.29,8.43 0 top
D7  18.88,8.43 0 top
D8  21.46,8.43 0 top
D9  24.05,8.43 0 top
D10  5.95,10.97 0 top
D11  8.54,10.97 0 top
D12  11.12,10.97 0 top
D13  13.71,10.97 0 top
D14  16.29,10.97 0 top
D15  18.88,10.97 0 top
D16  21.46,10.97 0 top
D17  24.05,10.97 0 top
D18  5.95,13.51 0 top
D19  8.54,13.51 0 top
D20  11.12,13.51 0 top
D21  13.71,13.51 0 top
D22  16.29,13.51 0 top
D23  18.88,13.51 0 top
D24  21.46,13.51 0 top
D25  24.05,13.51 0 top
D26  5.95,16.05 0 top
D27  8.54,16.05 0 top
D28  11.12,16.05 0 top
D29  13.71,16.05 0 top
D30  16.29,16.05 0 top
D31  18.88,16.05 0 top
D32  21.46,16.05 0 top
D33  24.05,16.05 0 top
D34  5.95,18.59 0 top
D35  8.54,18.59 0 top
D36  11.12,18.59 0 top
D37  13.71,18.59 0 top
D38  16.29,18.59 0 top
D39  18.88,18.59 0 top
D40  21.46,18.59 0 top
D41  24.05,18.59 0 top
D42  5.95,21.13 0 top
D43  8.54,21.13 0 top
D44  11.12,21.13 0 top
D45  13.71,21.13 0 top
D46  16.29,21.13 0 top
D47  18.88,21.13 0 top
D48  21.46,21.13 0 top
D49  24.05,21.13 0 top
D50  5.95,23.67 0 top
D51  8.54,23.67 0 top
D52  11.12,23.67 0 top
D53  13.71,23.67 0 top
D54  16.29,23.67 0 top
D55  18.88,23.67 0 top
D56  21.46,23.67 0 top
D57  24.05,23.67 0 top
D58  5.95,26.21 0 top
D59  8.54,26.21 0 top
D60  11.12,26.21 0 top
D61  13.71,26.21 0 top
D62  16.29,26.21 0 top
D63  18.88,26.21 0 top
D64  21.46,26.21 0 top
D65  24.05,26.21 0 top
D66  15,8.43 0 bottom
FB1  12.3,25.26 90 bottom
IC1  3.41,11.45 180 bottom
JP2  15,3.35 0 top
P1  15,17.32 30 top
PWR_IN  28.81,13.83 270 top
PWR_OUT  1.19,13.83 270 top
R  16.59,29.54 0 top
R1  12.46,28.43 180 bottom
R2  14.84,23.83 270 bottom
R3  13.57,5.41 0 bottom
R4  7.14,8.77 270 bottom
R5  4.44,8.73 180 bottom
SERIAL_IN  1.19,23.35 270 top
SERIAL_OUT  28.81,23.35 270 top
TRIMBLE-LOGO1  11.72,32.62 210 top
U1  15,15.26 270 bottom
X1  15.95,20.81 90 bottom

### Tracks (layer width: path | path; a pad name or v marks a point on that pad's centre or on a via)
+VS  (via drill 0.25)
  Route2 0.305: 24.05,25.58 21.51,25.58
  Route2 0.508: v8.9,7.79 9.49,8.37 10.73,8.37 11.65,9.29
  Bottom 0.152: IC1.8 2.89,10.46 C14.1
  Bottom 0.203: C14.1 2.46,11.75 1.72,12.48 1.72,13.29 PWR_OUT.1 | C22.1 17.51,7.65 v17.51,7.66 | C16.1 7.22,25.64 v7.2,25.62 | C20.1 v7.18,20.48 v7.18,20.49 | C9.1 v7.2,23 | C23.1 7.2,18.08 v7.2,18 | C24.1 7.2,15.54 v7.2,15.49
  other vias: 16.57,25.52 21.83,25.52 22.34,23 16.85,23 22.04,17.92 22.09,20.46 21.91,12.87 21.83,10.28 21.83,7.71 6.24,10.3 8.7,10.28 20.13,15.36 7.25,12.79 11.32,20.49 16.63,10.28
  pour Top (no thermals): 5.79,25.92 24.84,25.92 24.84,25.1 5.79,25.1
  pour Top (no thermals): 5.63,23.56 24.52,23.56 24.52,22.53 5.63,22.53
  pour Top (no thermals): 5.63,21.02 24.52,21.02 24.52,19.99 5.63,19.99
  pour Top (no thermals): 5.63,18.23 24.48,18.23 24.48,17.45 5.63,17.45
  pour Top (no thermals): 5.54,15.94 24.47,15.94 24.47,14.94 5.54,14.94
  pour Top (no thermals): 5.54,13.28 24.53,13.25 24.53,12.37 5.54,12.37
  pour Top (no thermals): 5.56,10.84 24.56,10.84 24.56,9.81 5.56,9.81
  pour Top (no thermals): 5.69,8.09 24.49,8.09 24.49,7.17 5.69,7.17
  pour Bottom (no thermals): 8.94,13.35 8.94,12.4 6.73,12.4 6.73,13.35
  pour Bottom (no thermals): 9.6,10.81 9.6,9.86 5.91,9.86 5.91,10.81
  pour Bottom (no thermals): 9.76,8.27 9.76,7.32 8.17,7.32 8.17,8.27
  pour Bottom (no thermals): 17.38,25.89 17.38,25.1 16.03,25.1 16.03,25.89
  pour Bottom (no thermals): 23.27,26.05 23.27,25.1 21.52,25.1 21.52,26.05
  pour Bottom (no thermals): 23.27,23.51 23.27,22.56 22,22.56 22,23.51
  pour Bottom (no thermals): 23.27,20.97 23.27,20.02 21.75,20.02 21.75,20.97
  pour Bottom (no thermals): 23.27,8.11 23.27,7.31 21.52,7.31 21.52,8.11
  pour Bottom (no thermals): 23.22,10.65 23.22,9.86 21.19,9.86 21.19,10.65
  pour Bottom (no thermals): 23.3,13.19 23.3,12.4 21.19,12.4 21.19,13.19
  pour Bottom (no thermals): 21.83,15.73 21.83,14.94 19.76,14.94 19.76,15.73
  pour Bottom (no thermals): 23.27,18.43 23.27,17.64 21.77,17.64 21.77,18.43
  pour Route2 (rank 3, no thermals): -0.09,25.94 14.89,34.6 29.99,25.9 30.03,8.69 15.04,0.04 0.02,8.6
CKI  (via drill 0.25 pad 0.55)
  Route15 0.203: v3.95,9.68 3.79,9.84 3.79,20.85 1.29,23.35 SERIAL_IN.1
  Bottom 0.152: IC1.6 3.59,10.04
  Bottom 0.203: R4.1 6.92,9.64 5.44,9.64 5.26,9.46 4.35,9.46 4.13,9.68 v3.95,9.68 v3.94,9.68 3.59,10.04
CKO  (via drill 0.25 pad 0.55)
  Top 0.203: D65.CO 25.15,26.22 25.45,25.92 25.45,24.58 v25.55,24.48
  Bottom 0.203: SERIAL_OUT.1 26.83,23.35 25.71,24.48 v25.55,24.48
CLK
  Route15 0.203: JP2.2 JP2.1
  Bottom 0.203: U1.36 12.25,5.89 | 12.25,5.89 12.25,3.56 JP2.1 | R3.2 12.73,5.41 12.25,5.89
DATA
  Bottom 0.203: U1.35 12.75,8.14 JP2.3
GND  (via drill 0.25, 0.25 pad 0.6, 0.3 pad 0.6, 0.35 pad 0.75)
  Top 0.203: 13.73,27.38 13.73,26.82 D61.GND
  Top 0.254: 13.73,27.38 13.21,27.9 D1.C
  Bottom 0.152: R2.1 v14.84,24.88 v14.85,24.88
  Bottom 0.305: U1.30 15.25,11.32 15.65,10.92 C3.2
  Bottom 0.406: D66.1 15.65,8.88 C4.2
  other vias: 3.25,25.73 5.93,27.45 2.46,14.15 11.15,27.4 5.98,24.83 18.87,27.38 24.16,27.45 15.01,17.09 7.21,17.12 20.22,17.12 14.99,4.73 17.55,14.6 9.83,14.53 22.78,14.55 22.76,22.1 15.01,22.1 7.24,22.1 9.83,12.01 7.24,19.56 20.19,19.56 9.83,9.4 17.6,9.37 22.76,9.4 20.17,11.94 15.04,29.62 15.39,28.5
  pour Top (no thermals): 5.63,27.48 5.63,26.34 24.37,26.34 24.37,27.48
  pour Top (no thermals): 5.63,24.83 5.63,23.91 24.52,23.91 24.52,24.83
  pour Top (no thermals): 5.63,22.27 5.63,21.39 24.52,21.39 24.52,22.27
  pour Top (no thermals): 5.66,19.73 5.66,18.72 24.48,18.72 24.48,19.73
  pour Top (no thermals): 5.58,17.19 5.58,16.26 24.47,16.26 24.47,17.19
  pour Top (no thermals): 5.63,14.67 5.63,13.62 24.47,13.62 24.47,14.67
  pour Top (no thermals): 5.63,12.08 5.63,11.13 24.47,11.1 24.47,12.11
  pour Top (no thermals): 5.54,9.54 5.54,8.69 24.47,8.69 24.47,9.54
  pour Bottom (no thermals): 5.63,27.8 5.63,26.53 8.81,26.53 8.81,27.64 8.65,27.8
  pour Bottom (no thermals): 5.63,24.78 5.63,23.83 8.81,23.83 8.81,24.78
  pour Bottom (no thermals): 5.63,22.24 5.63,21.29 8.81,21.29 8.81,22.24
  pour Bottom (no thermals): 5.63,17.16 5.63,16.37 8.81,16.37 8.81,17.16
  pour Bottom (no thermals): 5.63,14.62 5.63,13.67 8.81,13.67 8.81,14.62
  pour Bottom (no thermals): 5.63,12.08 5.63,11.13 9.6,11.13 9.6,12.08
  pour Bottom (no thermals): 8.17,9.54 8.17,8.59 9.76,8.59 9.76,9.54
  pour Bottom (no thermals): 10.87,27.48 10.87,26.21 17.38,26.21 17.38,27.48
  pour Bottom (no thermals): 16.75,20.02 15.48,20.02 15.48,23.99 14.5,23.99 14.5,24.78 17.38,24.78 17.38,21.13 16.75,20.5
  pour Bottom (no thermals): 21.19,27.48 21.19,26.37 24.37,26.37 24.37,27.48
  pour Bottom (no thermals): 21.19,24.78 21.19,23.83 24.37,23.83 24.37,24.78
  pour Bottom (no thermals): 21.19,22.24 21.19,21.29 24.37,21.29 24.37,22.24
  pour Bottom (no thermals): 21.19,19.7 21.19,18.75 24.37,18.75 24.37,19.7
  pour Bottom (no thermals): 21.19,9.57 21.19,8.59 24.37,8.59 24.37,9.57
  pour Bottom (no thermals): 21.19,11.92 21.19,11.13 24.37,11.13 24.37,11.92
  pour Bottom (no thermals): 21.19,14.46 21.19,13.67 24.37,13.67 24.37,14.46
  pour Bottom (no thermals): 19.76,17.16 19.76,16.37 21.83,16.37 21.83,17.16
  pour Bottom (no thermals): 15.32,11.13 15.32,8.43 18.17,8.43 18.17,11.13
  pour Bottom (rank 3, no thermals): -0.09,25.94 14.89,34.6 29.99,25.9 30.03,8.69 15.04,0.04 0.02,8.6
  pour Route15 (rank 5, no thermals): -0.09,25.94 14.97,34.64 29.99,25.99 30.03,8.69 15,0.02 0.02,8.55
L1_CLK  (via drill 0.25 pad 0.55)
  Top 0.203: D9.CO 25.31,8.44 v25.32,8.43 | v4.5,11.54 4.5,11.46 4.99,10.98 D10.CI
  Route15 0.203: v4.5,11.54 4.93,11.11 4.93,9.79 6.34,8.38 23.31,8.38 23.41,8.27 25.16,8.27 v25.32,8.43
L1_DATA  (via drill 0.25 pad 0.55)
  Top 0.203: D9.DO 25.02,9.08 v25.16,9.22 | D10.DI v5.25,11.62 v5.24,11.63
  Route15 0.203: v5.24,11.63 5.34,11.53 5.34,10.23 6.76,8.8 24.74,8.8 v25.16,9.22
L2_CLK  (via drill 0.25 pad 0.55)
  Top 0.203: D18.CI 5.36,13.54 4.97,13.54 v4.92,13.48 | D17.CO 25.31,10.98 v25.32,10.97
  Route15 0.203: v4.92,13.48 5.47,13.48 5.93,13.94 8.27,13.94 9.49,12.72 11.85,12.72 11.9,12.69 21.12,12.72 22.01,11.83 24.45,11.83 v25.32,10.97
L2_DATA  (via drill 0.25 pad 0.55)
  Top 0.203: D17.DO 24.87,11.84 v25.34,11.84 | D18.DI 5.19,14.16 v5.16,14.2
  Route15 0.203: v5.16,14.2 5.36,14.4 8.58,14.4 9.49,13.48 22.1,13.48 23.26,12.32 24.86,12.32 v25.34,11.84
L3_CLK  (via drill 0.25 pad 0.55)
  Top 0.203: v4.68,16.05 4.69,16.06 D26.CI | v25.41,12.57 25.41,13.18 25.07,13.52 D25.CO
  Route15 0.203: v4.68,16.05 5.93,14.81 8.74,14.81 9.68,13.87 22.29,13.87 23.41,12.75 25.24,12.75 v25.41,12.57
L3_DATA  (via drill 0.25 pad 0.55)
  Top 0.203: D26.DI 4.82,16.7 v4.68,16.84 | D25.DO 24.79,14.3 v25.16,14.3
  Route15 0.203: v4.68,16.84 5.47,16.05 22.63,16.05 23.82,14.86 24.6,14.86 v25.16,14.3
L4_CLK  (via drill 0.25 pad 0.55)
  Top 0.203: v4.68,17.64 4.68,18.27 5.01,18.6 D34.CI | v25.34,15.07 25.34,15.83 25.12,16.06 D33.CO
  Route15 0.203: v4.68,17.64 5.32,17.64 6.47,16.48 22.76,16.48 23.94,15.3 25.12,15.3 v25.34,15.07
L4_DATA  (via drill 0.25 pad 0.55)
  Top 0.203: D34.DI 4.82,19.24 v4.68,19.38 | D33.DO 25,16.7 25.1,16.8 v25.1,17.31
  Route15 0.203: v4.68,19.38 5.47,18.59 22.46,18.59 23.57,17.48 24.93,17.48 v25.1,17.31
L5_CLK  (via drill 0.25 pad 0.55)
  Top 0.203: 4.69,20.36 4.66,20.36 v4.63,20.39 4.63,20.62 5.11,21.1 5.34,21.1 D42.CI | D41.CO 24.67,18.63 25,18.63 25.52,19.14 v25.52,19.35
  Route15 0.203: v4.63,20.39 4.8,20.39 5.54,21.13 23.57,21.13 25.36,19.35 v25.52,19.35
L5_DATA  (via drill 0.25 pad 0.55)
  Top 0.203: v4.68,21.61 4.86,21.78 D42.DI | v25.41,20.2 25.36,20.2 24.65,19.48 D41.DO
  Route15 0.203: v25.41,20.2 25.3,20.2 23.96,21.54 4.75,21.54 v4.68,21.61
L6_CLK  (via drill 0.25 pad 0.55)
  Top 0.203: 25.22,21.09 v25.32,20.99 25.17,21.14 D49.CO | v4.66,23.35 4.83,23.35 5.16,23.68 D50.CI
  Route15 0.203: v25.32,20.99 25.32,21.13 22.75,23.7 5.3,23.7 4.96,23.35 v4.66,23.35
L6_DATA  (via drill 0.25 pad 0.55)
  Top 0.203: 25.26,21.98 v25.32,21.92 25.18,21.78 D49.DO | D50.DI 4.86,24.32 v4.63,24.09
  Route15 0.203: v4.63,24.09 22.93,24.09 25.1,21.92 v25.32,21.92
L7_CLK  (via drill 0.25 pad 0.55)
  Top 0.203: D57.CO 24.84,23.68 25.48,23.04 v25.48,22.88 | D58.CI 5.13,26.22 4.86,25.95 v4.7,25.95
  Route15 0.203: v25.48,22.88 25.27,22.88 21.97,26.18 5.49,26.18 5.26,25.95 v4.7,25.95
L7_DATA  (via drill 0.25 pad 0.55)
  Top 0.203: v25.63,23.7 25.48,23.7 24.86,24.32 D57.DO | D58.DI 5.07,26.86 4.9,26.7 v4.7,26.7
  Route15 0.203: v4.7,26.7 4.83,26.57 22.13,26.57 24.99,23.7 v25.63,23.7
N$1
  Top 0.203: D4.DI 10.32,9.08 10.07,8.83 9.59,8.83 9.34,9.08 D3.DO
N$2
  Top 0.203: D3.CO D4.CI
N$3  (via drill 0.3)
  Top 0.254: v11.85,29.39 11.85,28.57 D1.A
  Bottom 0.254: R1.2 12.15,29.39 v11.85,29.39
N$4
  Bottom 0.203: U1.10 16.75,19.11 17.7,20.06 17.7,24.09 C8.1 17.68,24.24 17.68,28.68 16.82,29.54 R.1
N$5
  Bottom 0.203: X1.P$1 17.15,20.46 16.25,19.56 U1.9
N$6
  Bottom 0.203: X1.P$3 14.75,20.59 15.75,19.59 U1.8
N$7
  Top 0.203: D2.DO D3.DI
N$8
  Top 0.203: D2.CO D3.CI
N$9
  Top 0.203: D9.DI 23.27,9.08 22.99,8.8 22.54,8.8 22.26,9.08 D8.DO
N$10
  Top 0.203: D9.CI 23.4,8.37 22.14,8.37 D8.CO
N$11
  Top 0.203: D8.CI D7.CO
N$12
  Top 0.203: D8.DI D7.DO
N$13
  Top 0.203: D5.CO D6.CI
N$14
  Top 0.203: D6.DI D5.DO
N$15
  Top 0.203: D17.CI D16.CO
N$16
  Top 0.203: D17.DI D16.DO
N$17
  Top 0.203: D11.CI D10.CO
N$18
  Top 0.203: D11.DI D10.DO
N$19
  Top 0.203: D12.CI D11.CO
N$20
  Top 0.203: D12.DI 10.42,11.62 10.24,11.44 9.49,11.44 9.31,11.62 D11.DO
N$21
  Top 0.203: D13.CI D12.CO
N$22
  Top 0.203: D18.CO D19.CI
N$23
  Top 0.203: D19.DI D18.DO
N$24
  Top 0.203: D19.CO D20.CI
N$25
  Top 0.203: D20.DI 10.37,14.16 10.17,13.96 9.54,13.96 9.34,14.16 D19.DO
N$26
  Top 0.203: D20.CO D21.CI
N$27
  Top 0.203: D20.DO D21.DI
N$28
  Top 0.203: D21.CO D22.CI
N$29
  Top 0.203: D22.DI D21.DO
N$30
  Top 0.203: D22.CO D23.CI
N$31
  Top 0.203: D23.DI 18.18,14.03 17.02,14.03 D22.DO
N$32
  Top 0.203: D24.CI D23.CO
N$33
  Top 0.203: D24.DI D23.DO
N$34
  Top 0.203: D25.CI D24.CO
N$35
  Top 0.203: D25.DI 23.35,14.16 23.17,13.98 22.42,13.98 22.24,14.16 D24.DO
N$36
  Top 0.203: D26.CO D27.CI
N$37
  Top 0.203: D27.DI 7.81,16.55 6.7,16.55 D26.DO
N$38
  Top 0.203: D27.CO D28.CI
N$39
  Top 0.203: D27.DO D28.DI
N$40
  Top 0.203: D29.CI D28.CO
N$41
  Top 0.203: D28.DO D29.DI
N$42
  Top 0.203: D30.CI D29.CO
N$43
  Top 0.203: D29.DO 14.43,16.7 14.61,16.52 15.42,16.52 15.59,16.7 D30.DI
N$44
  Top 0.203: D31.CO D32.CI
N$45
  Top 0.203: D31.DO 19.63,16.55 20.74,16.55 D32.DI
N$46
  Top 0.203: D31.CI D30.CO
N$47
  Top 0.203: D30.DO D31.DI
N$48
  Top 0.203: D32.CO D33.CI
N$49
  Top 0.203: D33.DI D32.DO
N$50
  Top 0.203: D34.CO D35.CI
N$51
  Top 0.203: D34.DO 6.75,19.24 7.01,18.99 7.48,18.99 7.74,19.24 D35.DI
N$52
  Top 0.203: D35.CO D36.CI
N$53
  Top 0.203: D35.DO D36.DI
N$54
  Top 0.203: D36.CO D37.CI
N$55
  Top 0.203: D36.DO D37.DI
N$56
  Top 0.203: D37.CO D38.CI
N$57
  Top 0.203: D38.DI D37.DO
N$58
  Top 0.203: D38.CO D39.CI
N$59
  Top 0.203: D39.DI D38.DO
N$60
  Top 0.203: D41.CI D40.CO
N$61
  Top 0.203: D41.DI D40.DO
N$62
  Top 0.203: D40.CI D39.CO
N$63
  Top 0.203: D40.DI 20.69,19.24 20.43,18.99 19.93,18.99 19.68,19.24 D39.DO
N$64
  Top 0.203: D48.CO 22.24,21.14 22.31,21.07 23.27,21.07 23.35,21.14 D49.CI
N$65
  Top 0.203: D49.DI 23.27,21.78 22.97,21.48 22.57,21.48 22.26,21.78 D48.DO
N$66
  Top 0.203: D57.CI D56.CO
N$67
  Top 0.203: D56.DO D57.DI
N$68
  Top 0.203: D65.CI D64.CO
N$69
  Top 0.203: D64.DO D65.DI
N$70
  Top 0.203: D56.DI D55.DO
N$71
  Top 0.203: D55.CO D56.CI
N$72
  Top 0.203: D63.CO D64.CI
N$73
  Top 0.203: D64.DI D63.DO
N$74
  Top 0.203: D54.CO D55.CI
N$75
  Top 0.203: D54.DO D55.DI
N$76
  Top 0.203: D62.CO D63.CI
N$77
  Top 0.203: D63.DI D62.DO
N$78
  Top 0.203: D62.DI D61.DO
N$79
  Top 0.203: D61.CO D62.CI
N$80
  Top 0.203: D61.CI D60.CO
N$81
  Top 0.203: D61.DI D60.DO
N$82
  Top 0.203: D59.CO D60.CI
N$83
  Top 0.203: D60.DI D59.DO
N$84
  Top 0.203: D58.DO D59.DI
N$85
  Top 0.203: D58.CO D59.CI
N$86
  Top 0.203: D53.DO D54.DI
N$87
  Top 0.203: D53.CO D54.CI
N$88
  Top 0.203: D51.CO D52.CI
N$89
  Top 0.203: D51.DO 9.29,24.17 10.4,24.17 D52.DI
N$90
  Top 0.203: D53.DI D52.DO
N$91
  Top 0.203: D52.CO D53.CI
N$92
  Top 0.203: D50.DO D51.DI
N$93
  Top 0.203: D50.CO D51.CI
N$94
  Top 0.203: D42.CO 6.62,21.07 7.89,21.07 D43.CI
N$95
  Top 0.203: D43.DI 7.76,21.78 7.46,21.48 7.06,21.48 6.75,21.78 D42.DO
N$96
  Top 0.203: D44.CI D43.CO
N$97
  Top 0.203: D44.DI D43.DO
N$98
  Top 0.203: D44.CO D45.CI
N$99
  Top 0.203: D45.DI D44.DO
N$100
  Top 0.203: D46.DI 15.52,21.78 15.26,21.53 14.76,21.53 14.51,21.78 D45.DO
N$101
  Top 0.203: D45.CO D46.CI
N$102
  Top 0.203: D47.CI D46.CO
N$103
  Top 0.203: D47.DI D46.DO
N$104
  Top 0.203: D47.CO D48.CI
N$105
  Top 0.203: D48.DI D47.DO
N$106
  Top 0.203: D12.DO D13.DI
N$107
  Top 0.203: D13.DO D14.DI
N$108
  Top 0.203: D14.CI D13.CO
N$109
  Top 0.203: D14.CO D15.CI
N$110
  Top 0.203: D15.DI D14.DO
N$111
  Top 0.203: D15.CO 19.55,10.91 20.81,10.91 D16.CI
N$112
  Top 0.203: D16.DI 20.69,11.62 20.36,11.29 20.01,11.29 19.68,11.62 D15.DO
N$113
  Top 0.203: D4.CO D5.CI
N$114
  Top 0.203: D4.DO D5.DI
N$115
  Top 0.203: D7.CI 18.15,8.29 17.22,8.29 17.07,8.44 D6.CO
N$116
  Top 0.203: D7.DI 18.1,9.08 17.8,8.78 17.4,8.78 17.09,9.08 D6.DO
N$117
  Bottom 0.203: U1.1 11.49,18.64 11.45,18.6 10.93,18.6 9.81,19.71 9.81,26.92 11.33,28.43 R1.1
N$119  (via drill 0.3 pad 0.55)
  Top 0.203: D2.DI 5.3,9.01 4.9,9.01 4.71,8.82 v4.66,8.82
  Bottom 0.203: v4.66,8.82 4.66,8.68 R5.2
N$120  (via drill 0.3 pad 0.55)
  Top 0.203: D2.CI 5.15,8.44 4.84,8.13 4.84,7.46 5.22,7.08 v5.78,7.08
  Bottom 0.203: v5.78,7.08 5.8,7.05 7.01,8.25 R4.2
SDI  (via drill 0.25 pad 0.55)
  Route15 0.203: v3.71,8.84 3.71,9.01 3.39,9.33 3.39,19.45 2.03,20.81 SERIAL_IN.2
  Bottom 0.152: IC1.7 3.24,9.31
  Bottom 0.203: R5.1 3.71,8.81 v3.71,8.84 3.24,9.31
SDO  (via drill 0.25 pad 0.55)
  Top 0.203: SERIAL_OUT.2 26.28,23.35 26.28,26.05 v25.16,27.16 24.86,26.86 D65.DO
SPI1_MOSI
  Bottom 0.152: IC1.2 3.24,12.58 4.48,13.83
  Bottom 0.203: U1.44 10.42,16.01 9.33,14.91 5.03,14.91 4.48,14.36 4.48,13.83
SPI1_SCK
  Bottom 0.152: 4.17,12.91 3.59,12.33 IC1.3
  Bottom 0.203: U1.42 11.18,15.01 9.68,13.51 6.63,13.51 6.03,12.91 4.17,12.91
USART1_RX
  Bottom 0.203: U1.46 10.39,17.01 8.65,18.75 2.13,18.75 P1.PAD_PD5
USART1_TX  (via drill 0.25 pad 0.55)
  Top 0.305: v2.41,15.07 2.41,15.6 P1.PAD_PU5
  Bottom 0.203: U1.45 9.67,16.51 9.37,16.21 5.77,16.21 4.63,15.07 v2.41,15.07
USART2_RX
  Bottom 0.203: U1.14 19.37,17.51 19.55,17.68 20.48,17.68 21.82,16.34 27.32,16.34 28.3,17.32 P1.PAD_PD2
USART2_TX  (via drill 0.25 pad 0.55)
  Top 0.305: v26.79,18.3 28.33,18.3 P1.PAD_PU2
  Bottom 0.203: v26.79,18.3 26.79,17.92 25.6,16.73 22,16.73 20.56,18.16 18.53,18.16 U1.13
USART3_RX
  Bottom 0.203: P1.PAD_PD3 22.15,4.94 | 22.15,4.94 22.15,5.13 | U1.23 20.3,13.01 20.83,12.48 20.83,7.84 20.43,7.44 20.43,6.93 20.44,6.92 20.44,6.66 22.15,4.94
USART3_TX  (via drill 0.25 pad 0.55)
  Top 0.203: 20.99,6.09 v20.99,7.16
  Top 0.305: P1.PAD_PU3 20.99,6.09
  Bottom 0.203: U1.22 18.42,13.46 20.38,13.46 21.21,12.64 21.21,7.68 20.99,7.46 v20.99,7.16
USART4_RX
  Bottom 0.203: U1.12 17.75,18.95 20.18,21.38 20.18,27.21 22.15,29.19 P1.PAD_PD1
USART4_TX  (via drill 0.25 pad 0.55)
  Top 0.305: P1.PAD_PU1 21.66,29.71 v20.11,28.16
  Bottom 0.203: v20.11,28.16 19.79,27.84 19.79,21.57 17.24,19.02 U1.11
USART5_RX
  Bottom 0.203: U1.40 11.28,14.01 11.06,13.79 11.06,6.4 9.59,4.93 P1.PAD_PD4
USART5_TX  (via drill 0.25 pad 0.55)
  Top 0.305: v9.87,6.64 8.17,4.93 P1.PAD_PU4
  Bottom 0.203: U1.41 11.24,14.51 10.67,13.93 10.67,7.44 v9.87,6.64
USART6_RX
  Bottom 0.203: P1.PAD_PD6 9.43,28.13 9.43,19.3 10.72,18.01 U1.48
USART6_TX  (via drill 0.25 pad 0.55)
  Top 0.254: v5,28.12 6.25,28.12 P1.PAD_PU6
  Bottom 0.203: U1.47 10.52,17.51 10.51,17.5 9.05,18.96 9.05,25.7 8.4,26.35 5.56,26.35 5.32,26.58 5.32,27.79 v5,28.12
VDD  (via drill 0.25, 0.3 pad 0.6, 0.35 pad 0.75)
  Top 0.203: v4.36,10.81 3.57,10.81 2.93,11.45
  Top 0.406: v16.27,32.24 14.19,30.16 14.19,28.29 v14.36,28.12 | v17.98,4.82 v17.97,4.82 v17.18,4.82
  Bottom 0.152: IC1.5 3.94,10.73 4.28,10.73 v4.36,10.81 | IC1.1 2.89,12.77 2.66,12.99
  Bottom 0.203: v2.78,13.35 2.78,13.11 2.66,12.99 C13.1 2.61,12.85
  Bottom 0.305: U1.31 14.75,11.05 C3.1
  Bottom 0.406: v14.36,28.12 12.36,26.11 FB1.2 | 14.44,8.43 14.44,9.2 14.35,9.28 C4.1 C3.1 | 14.44,8.43 14.44,7.57 v17.18,4.82 | D66.2 14.44,8.43
  other vias: 27.86,10.02 27.06,9.38 11.52,5.05 0.63,12.56 4.07,7.05 27.06,15.42 26.11,15.42 27.99,24.46 27.22,24.46 16.88,32.85
  pour Route2 (no thermals): 30.08,10.65 27.88,10.65 26.62,9.57 23.05,6.6 21.61,6.33 9.03,7.46 -0.08,10.97 -0.08,8.75 15,0.02 30.08,8.75
  pour Top (no thermals): 27.53,10.81 26.09,9.75 25.88,8.45 26.29,6.72 26.43,6.53 30.08,8.75 30.08,10.81
  pour Top (no thermals): 10.74,6.8 18.99,6.8 19.98,2.83 15.04,0.04 10.04,2.95 10.68,6.75
  pour Top (no thermals): 0.24,10.97 5.7,6.38 5.26,5.73 -0.08,8.75 -0.08,10.97
  pour Top (no thermals): 28.02,7.32 27.54,15.73 25.79,15.73 25.95,6.37
  pour Top (no thermals): 28.33,27 26.75,24.46 28.02,23.35 30.08,23.99 30.08,25.89
  pour Route2 (no thermals): 25.64,14.94 29.45,14.94 28.49,20.02 28.02,23.67 28.65,24.31 28.49,24.94 25.95,24.94 25.64,15.26
  pour Route2 (no thermals): 30.08,23.83 25.95,23.83 24.21,25.89 19.92,28.91 15,32.4 13.25,33.67 14.84,34.62 30.08,25.89
  pour Top (no thermals): 13.25,33.67 16.11,31.45 17.7,33.04 15,34.62
  pour Top (no thermals): 3.89,6.84 3.89,28.27 -0.08,25.89 -0.08,24.15 2.14,23.99 1.99,13.35 -0.08,13.35 -0.08,11.92 1.98,11.92 1.98,7.64
VDDA
  Bottom 0.305: FB1.1 11.93,24.03 11.93,23.04
  pour Bottom (no thermals): 14.84,18.43 14.84,18.59 13.73,19.7 12.62,19.7 12.62,24.94 11.82,24.94 11.82,19.38 12.14,19.07 13.41,19.07 13.57,18.91 13.57,18.43
VSSA
  Bottom 0.305: U1.7 15.23,18.66 15.23,19.5 14.95,19.78 14.42,19.78 13.86,20.34 C6.2
  pour Bottom (no thermals): 13.89,20.02 13.89,22.72 15.16,22.72 15.16,23.51 13.09,23.51 13.09,20.02

### Text on the board
tPlace: 3V3 | P6 | P1 | 3V3 | 3V3 | CI | CO | DI | DO | P5 | P2* | 5V | 5V | GND | GND | 3V3 | 3V3 | P3 | P4 | B | C | D
bPlace: GND | P6 | P1 | GND | GND | H16R60 | P5 | P2* | GND | P4 | P3
bNames: U1